# EAGLE schematic main_02_feb_18 (EAGLE 7.6.0), part 1 of 2
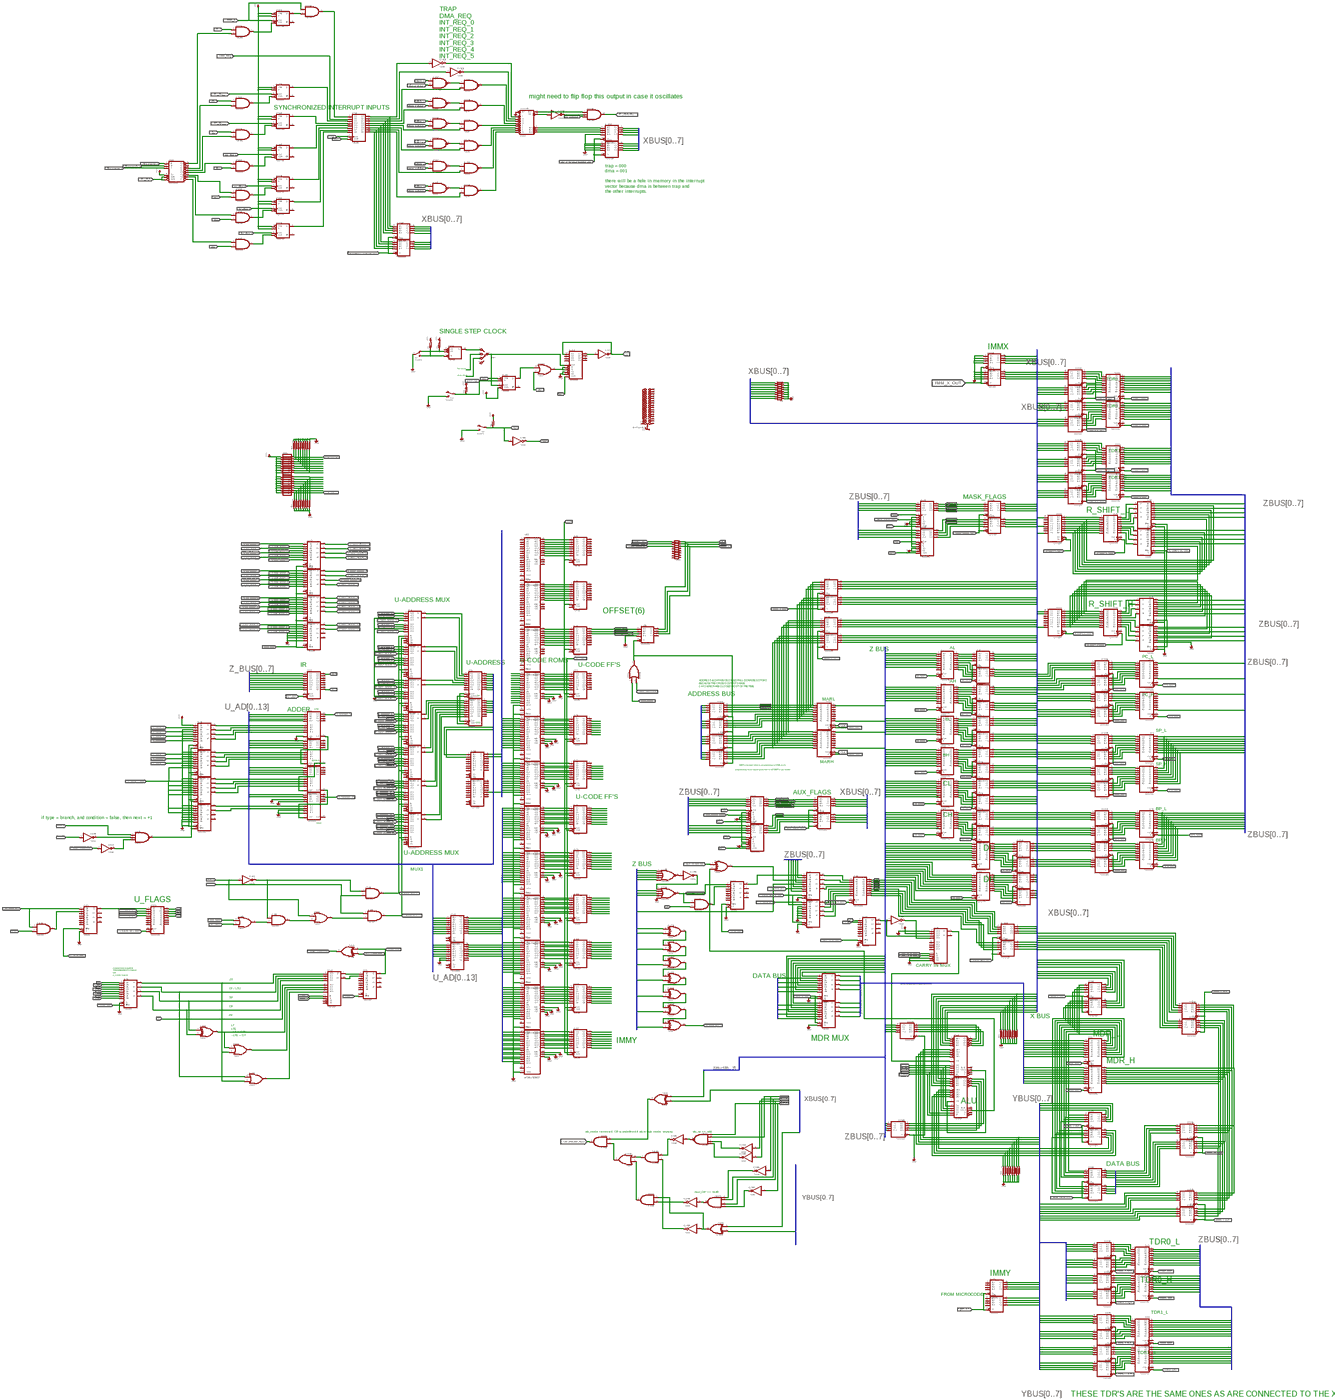
[diagram p0: schematic, sheet 1, overview]
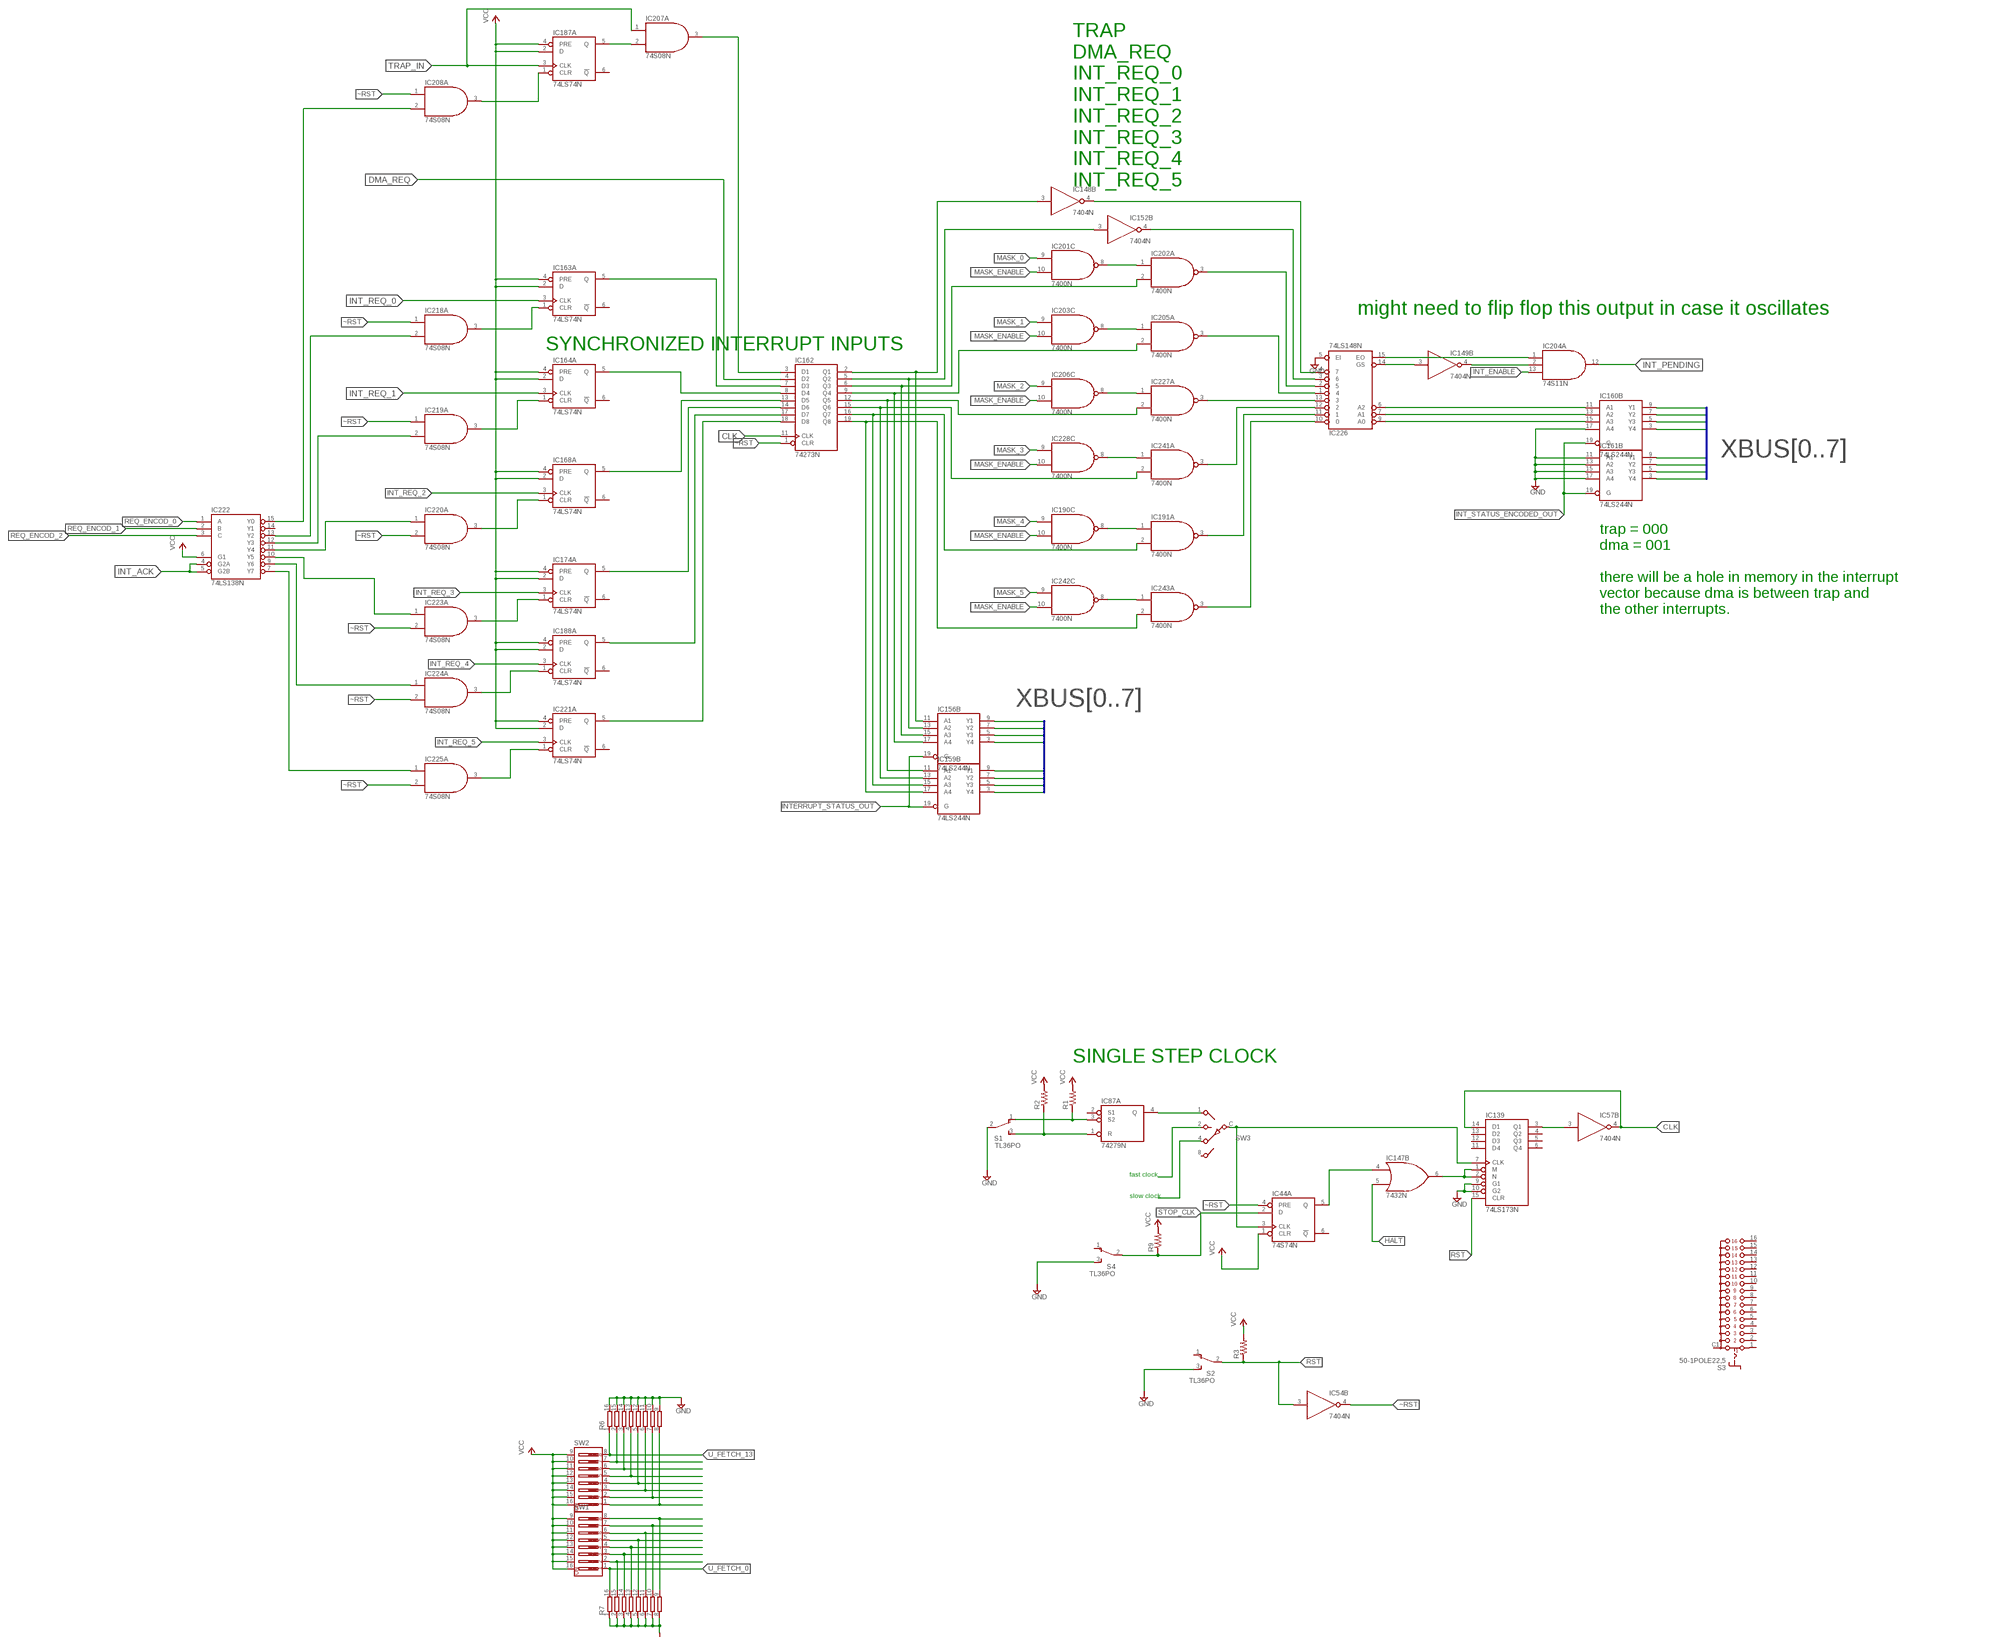
[diagram p1: schematic, sheet 1, part 1 of 7]
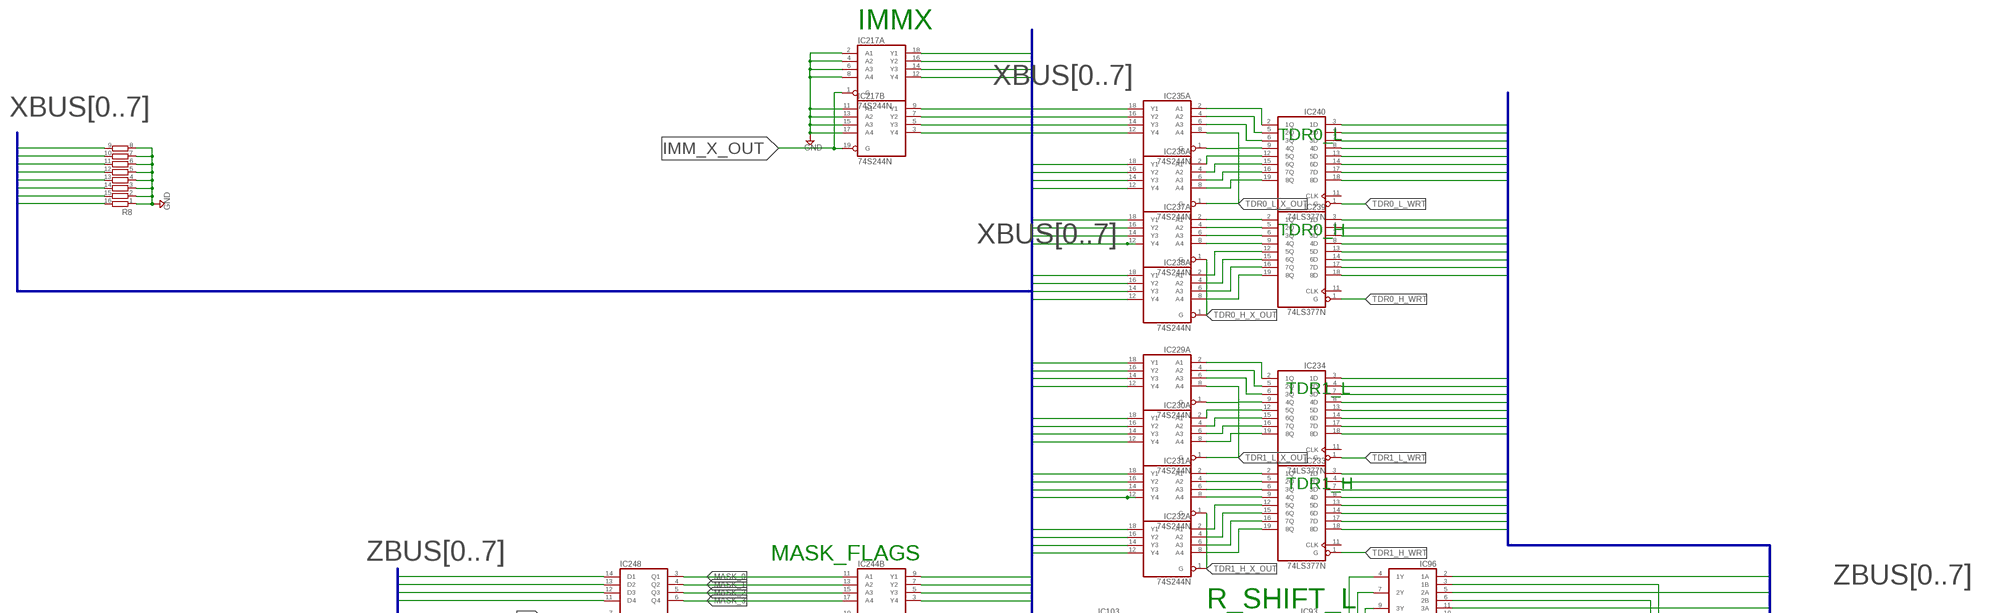
[diagram p2: schematic, sheet 1, part 2 of 7]
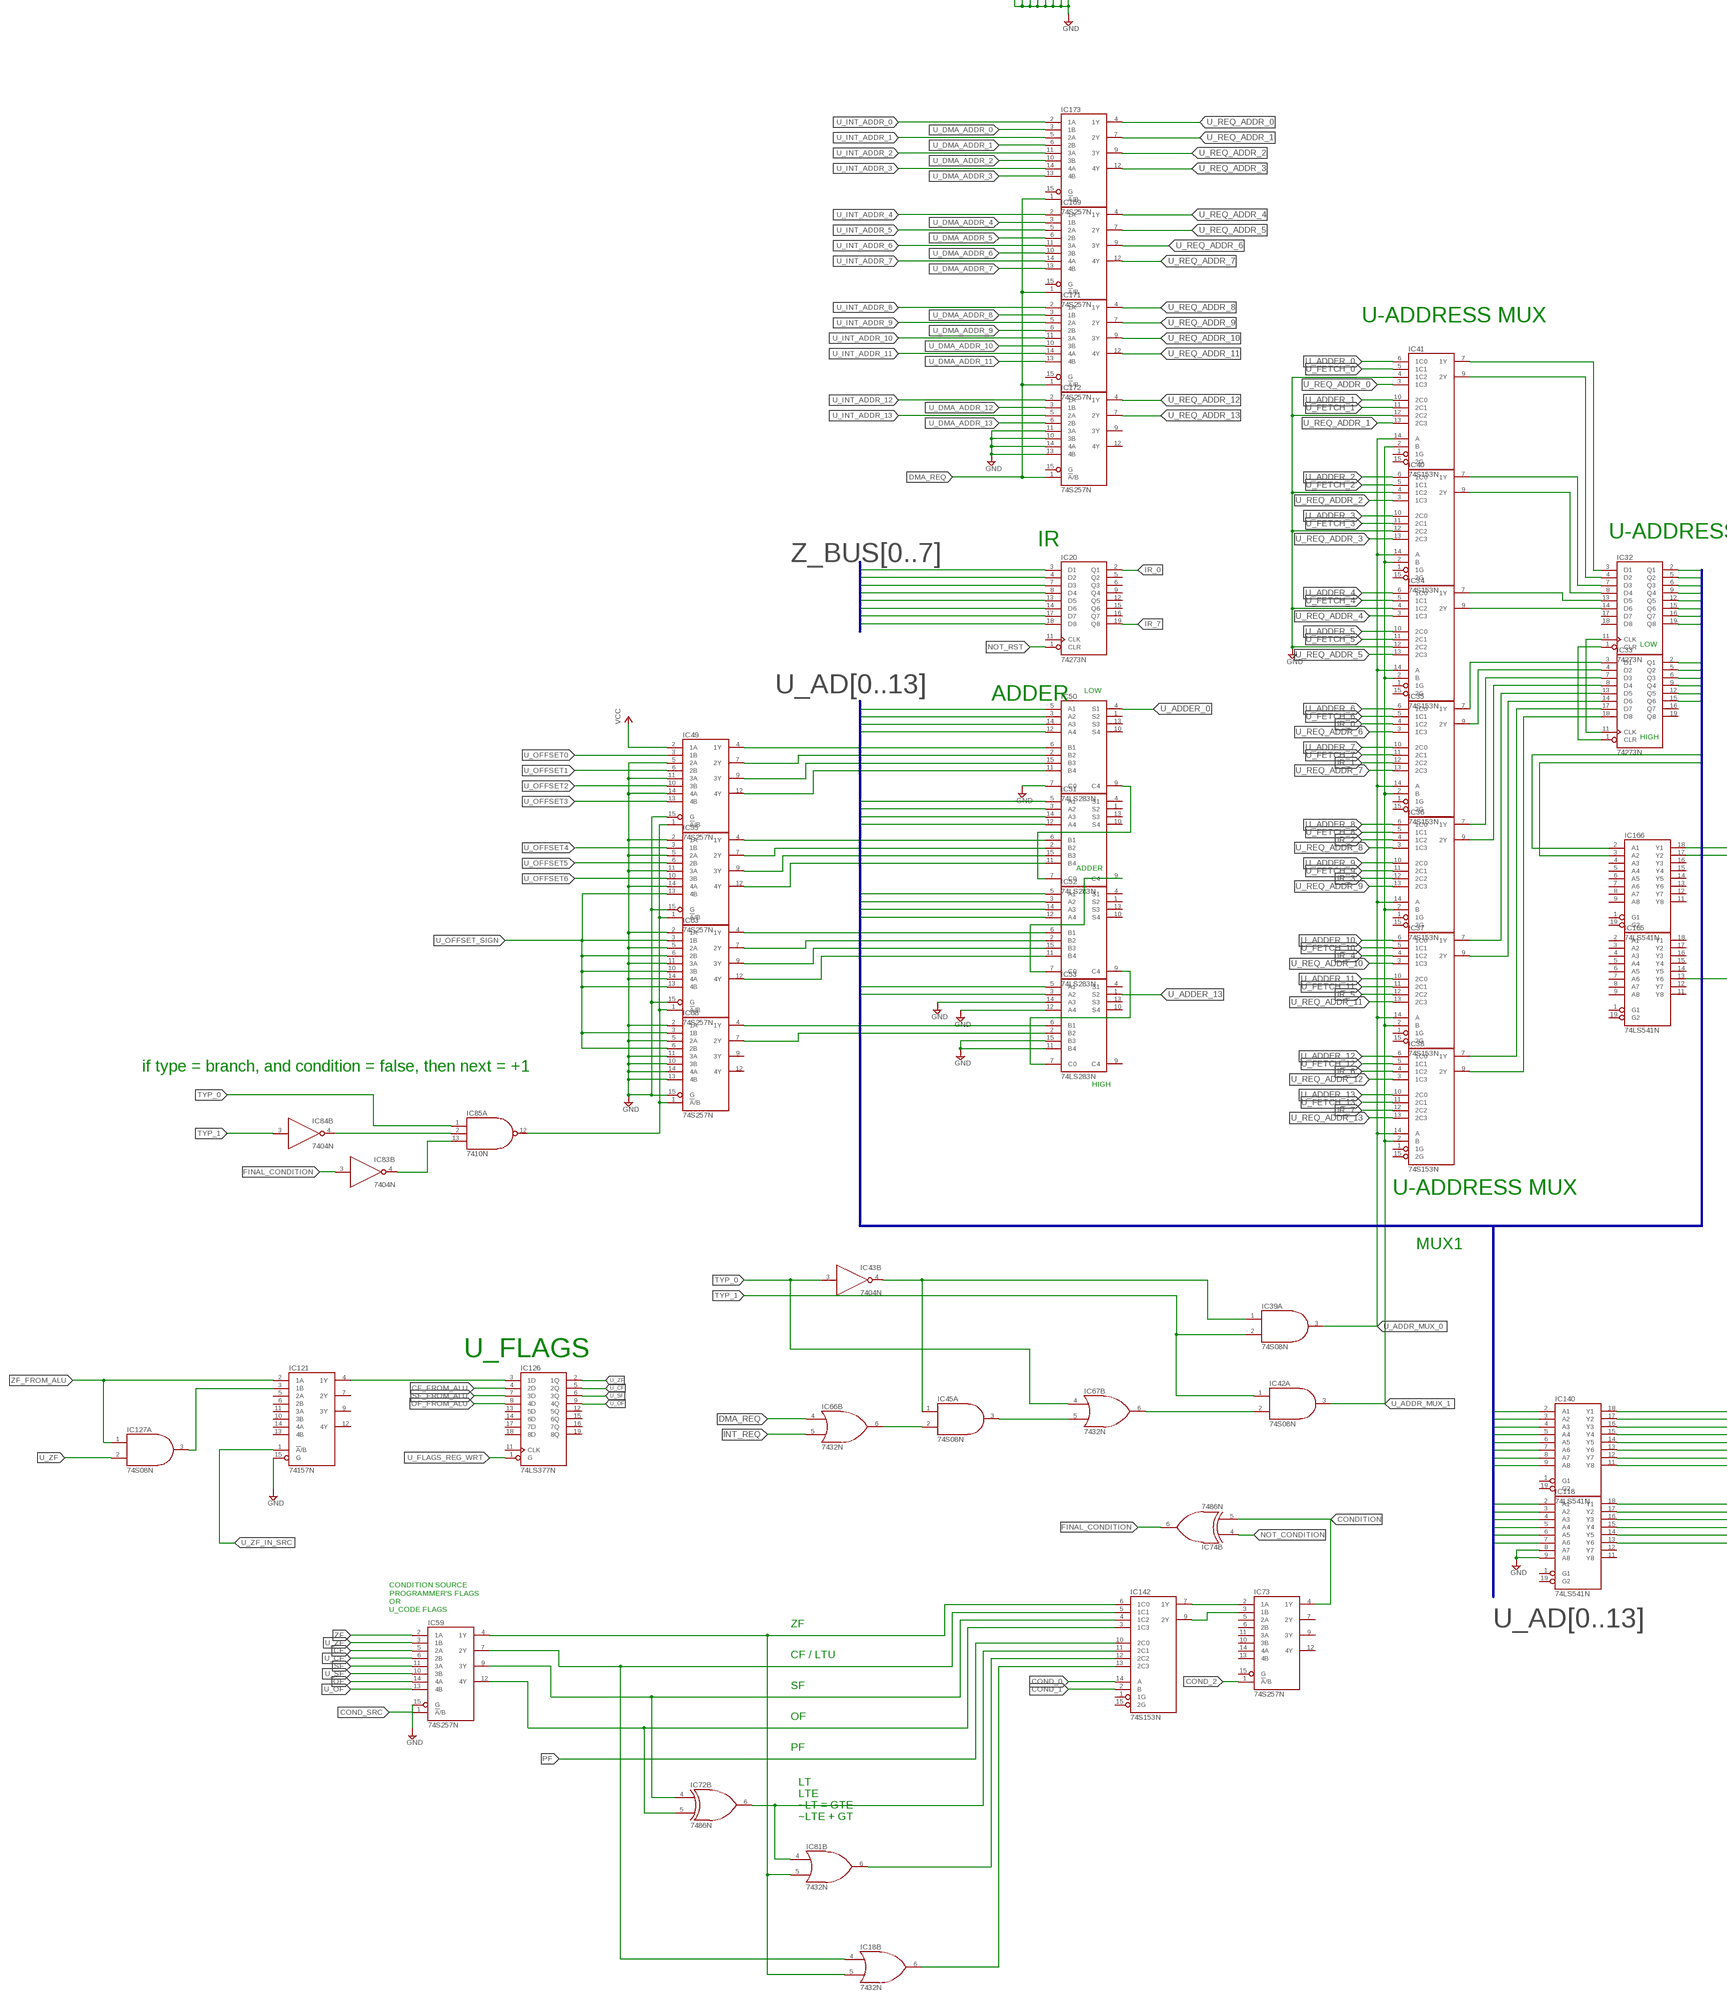
[diagram p3: schematic, sheet 1, part 3 of 7]
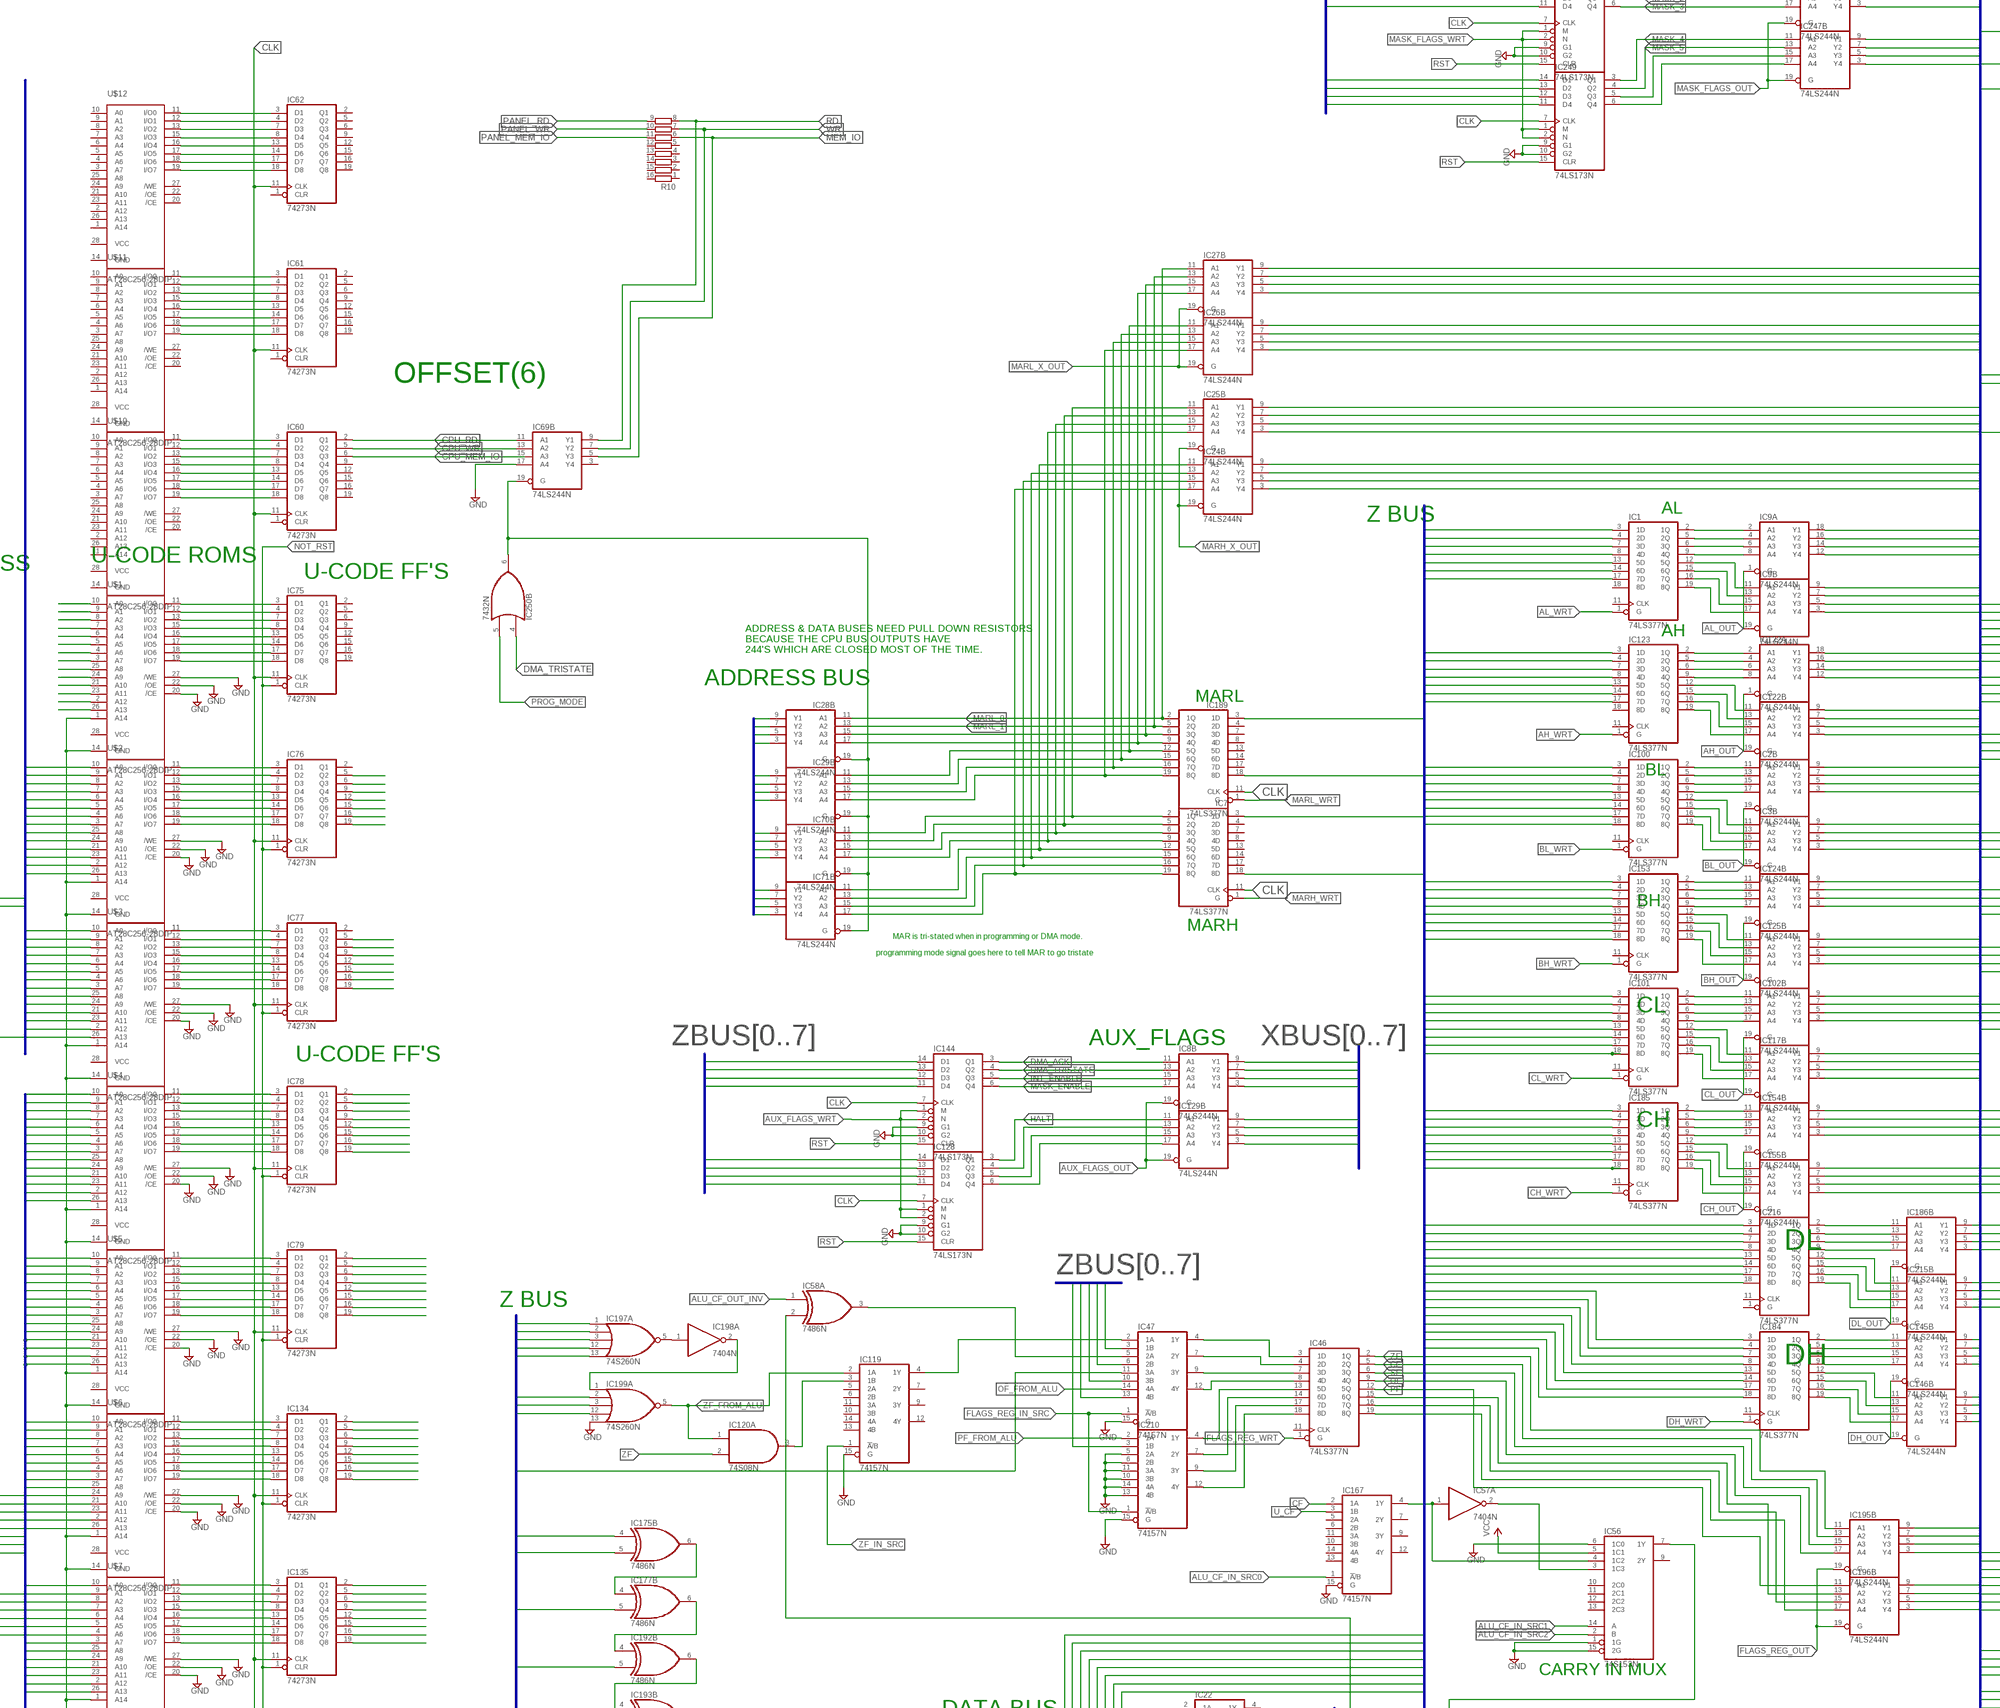
[diagram p4: schematic, sheet 1, part 4 of 7]
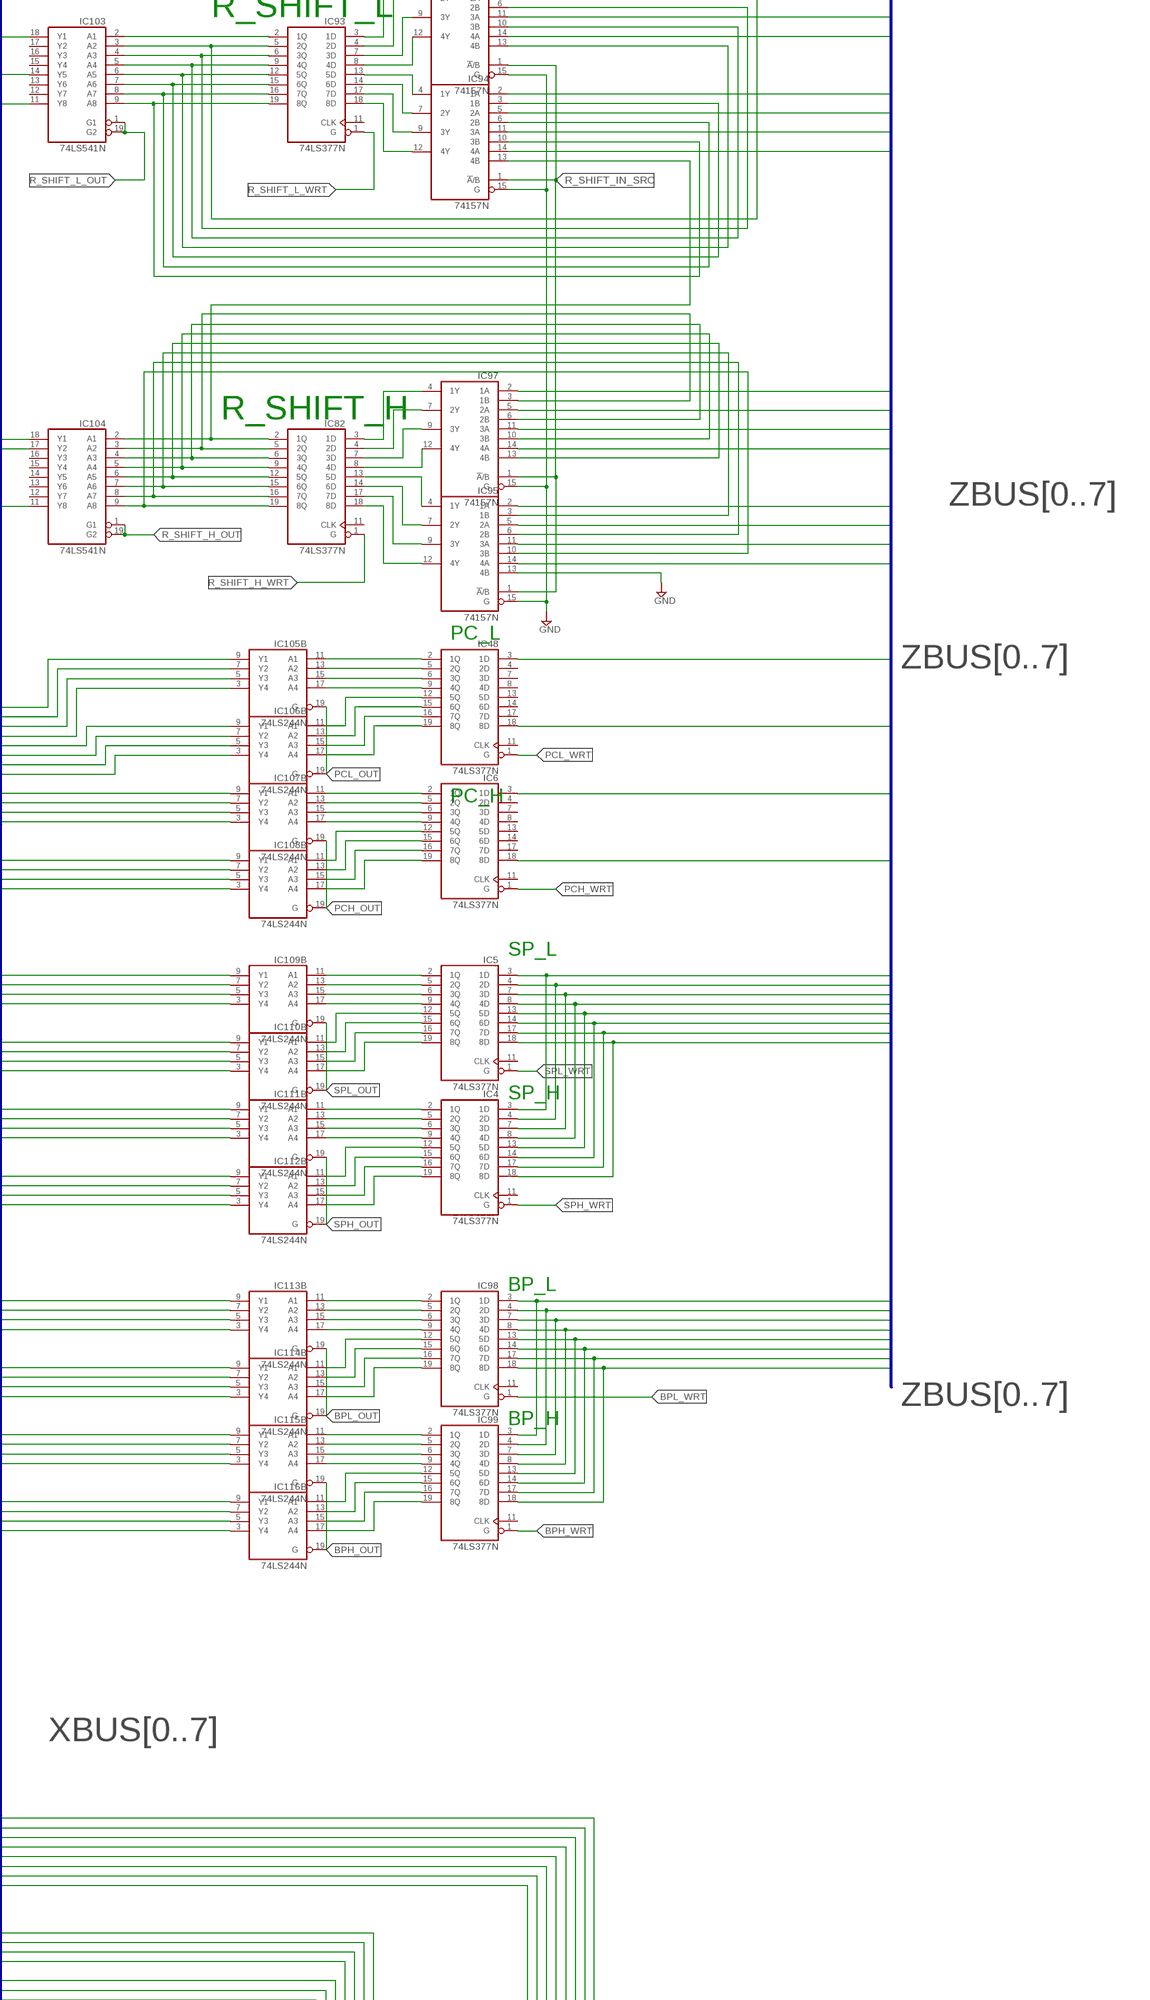
[diagram p5: schematic, sheet 1, part 5 of 7]
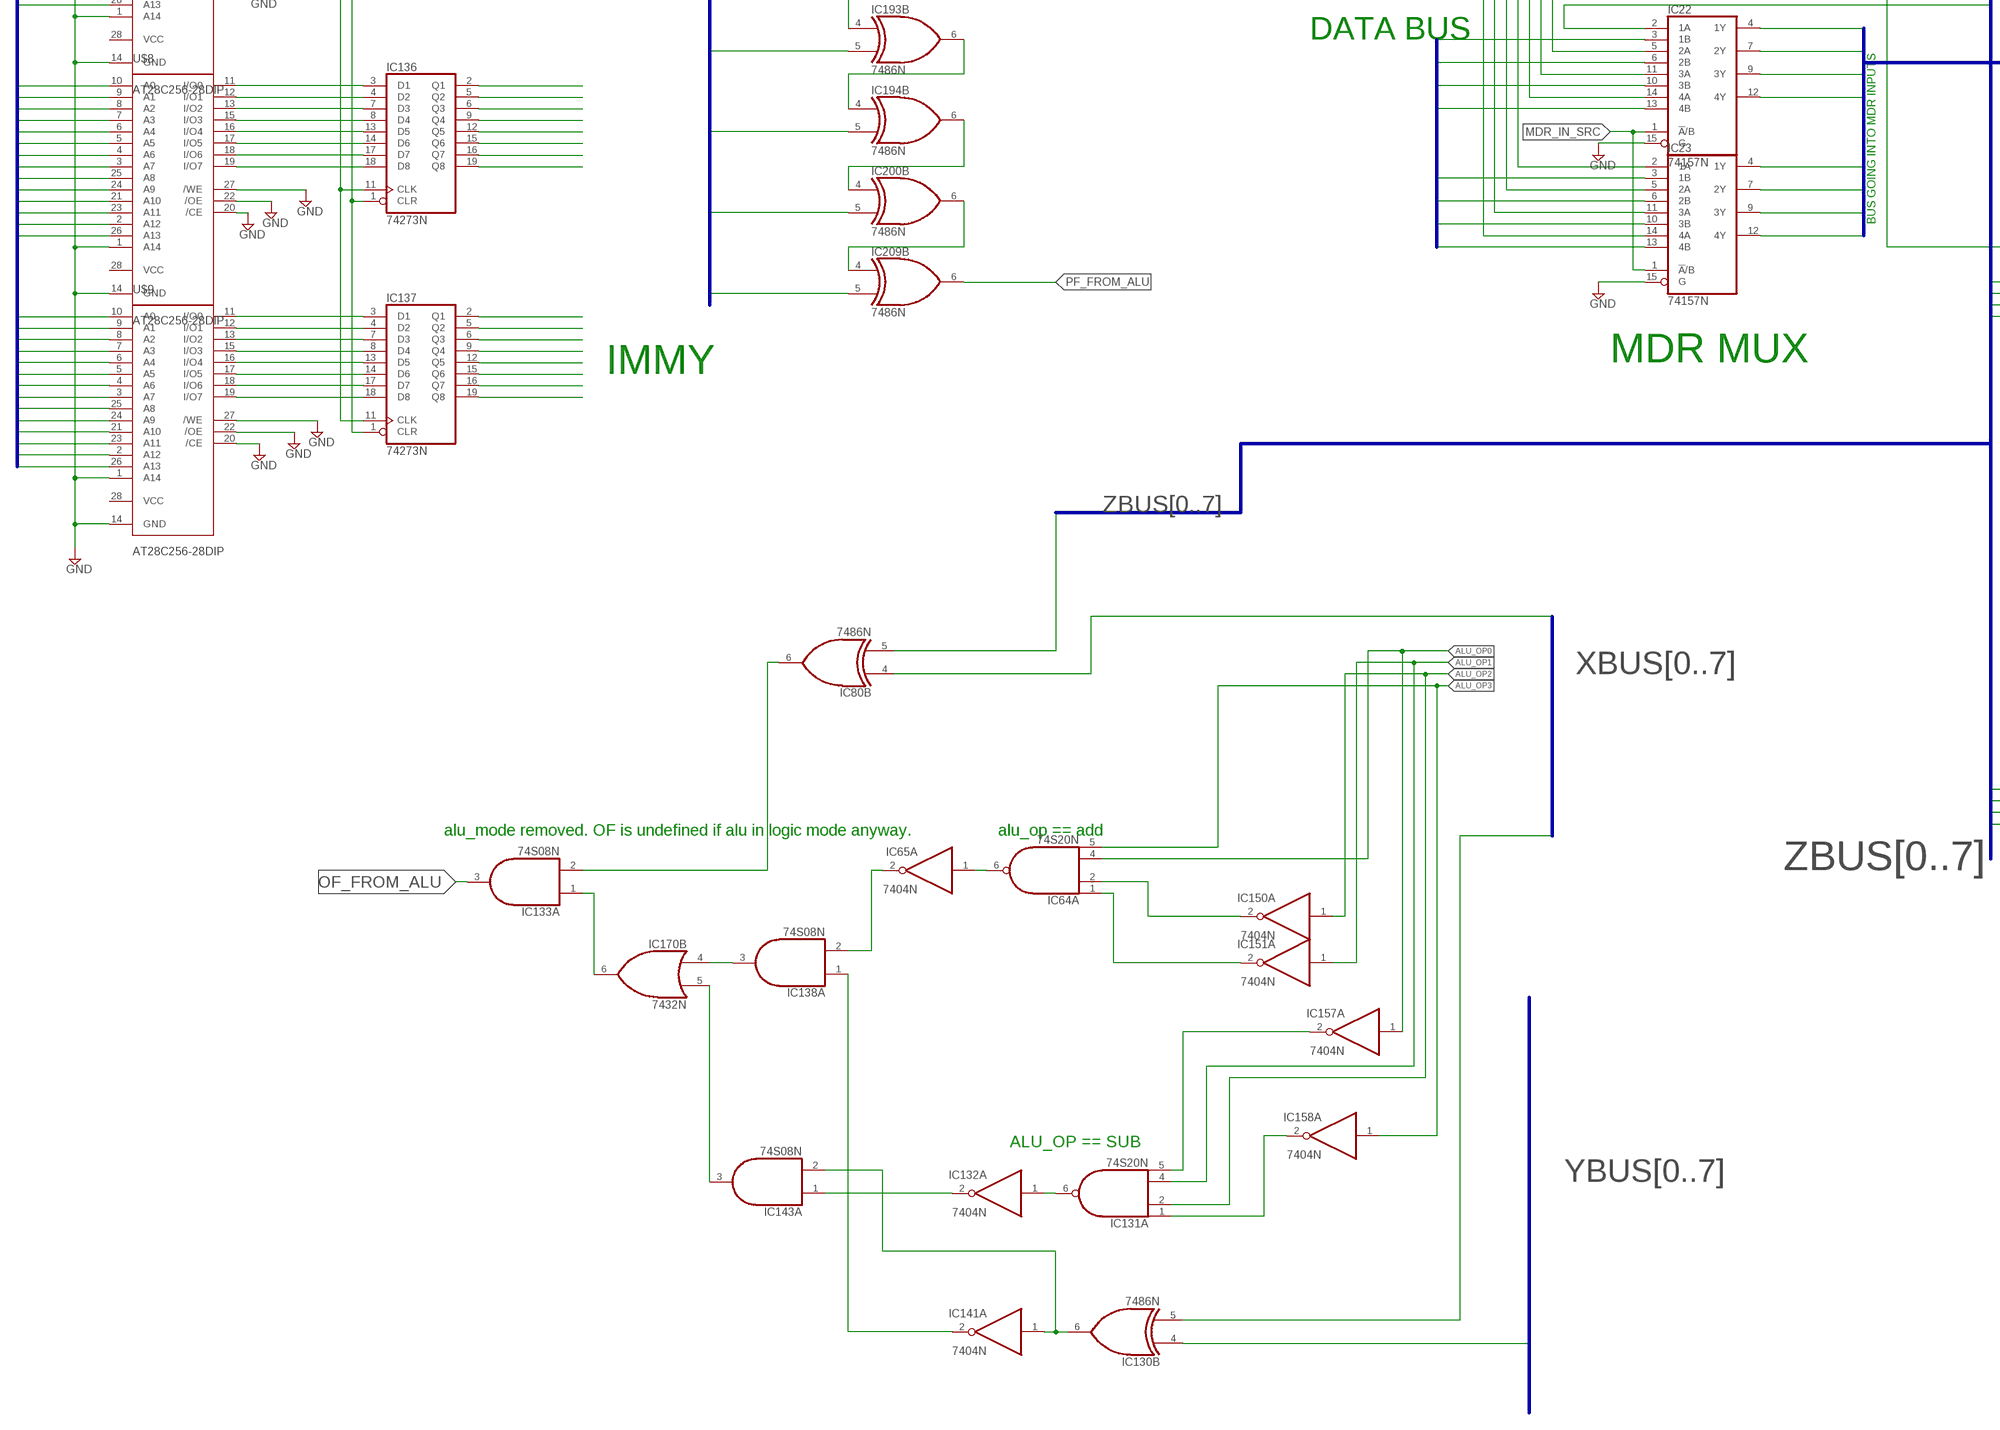
[diagram p6: schematic, sheet 1, part 6 of 7]
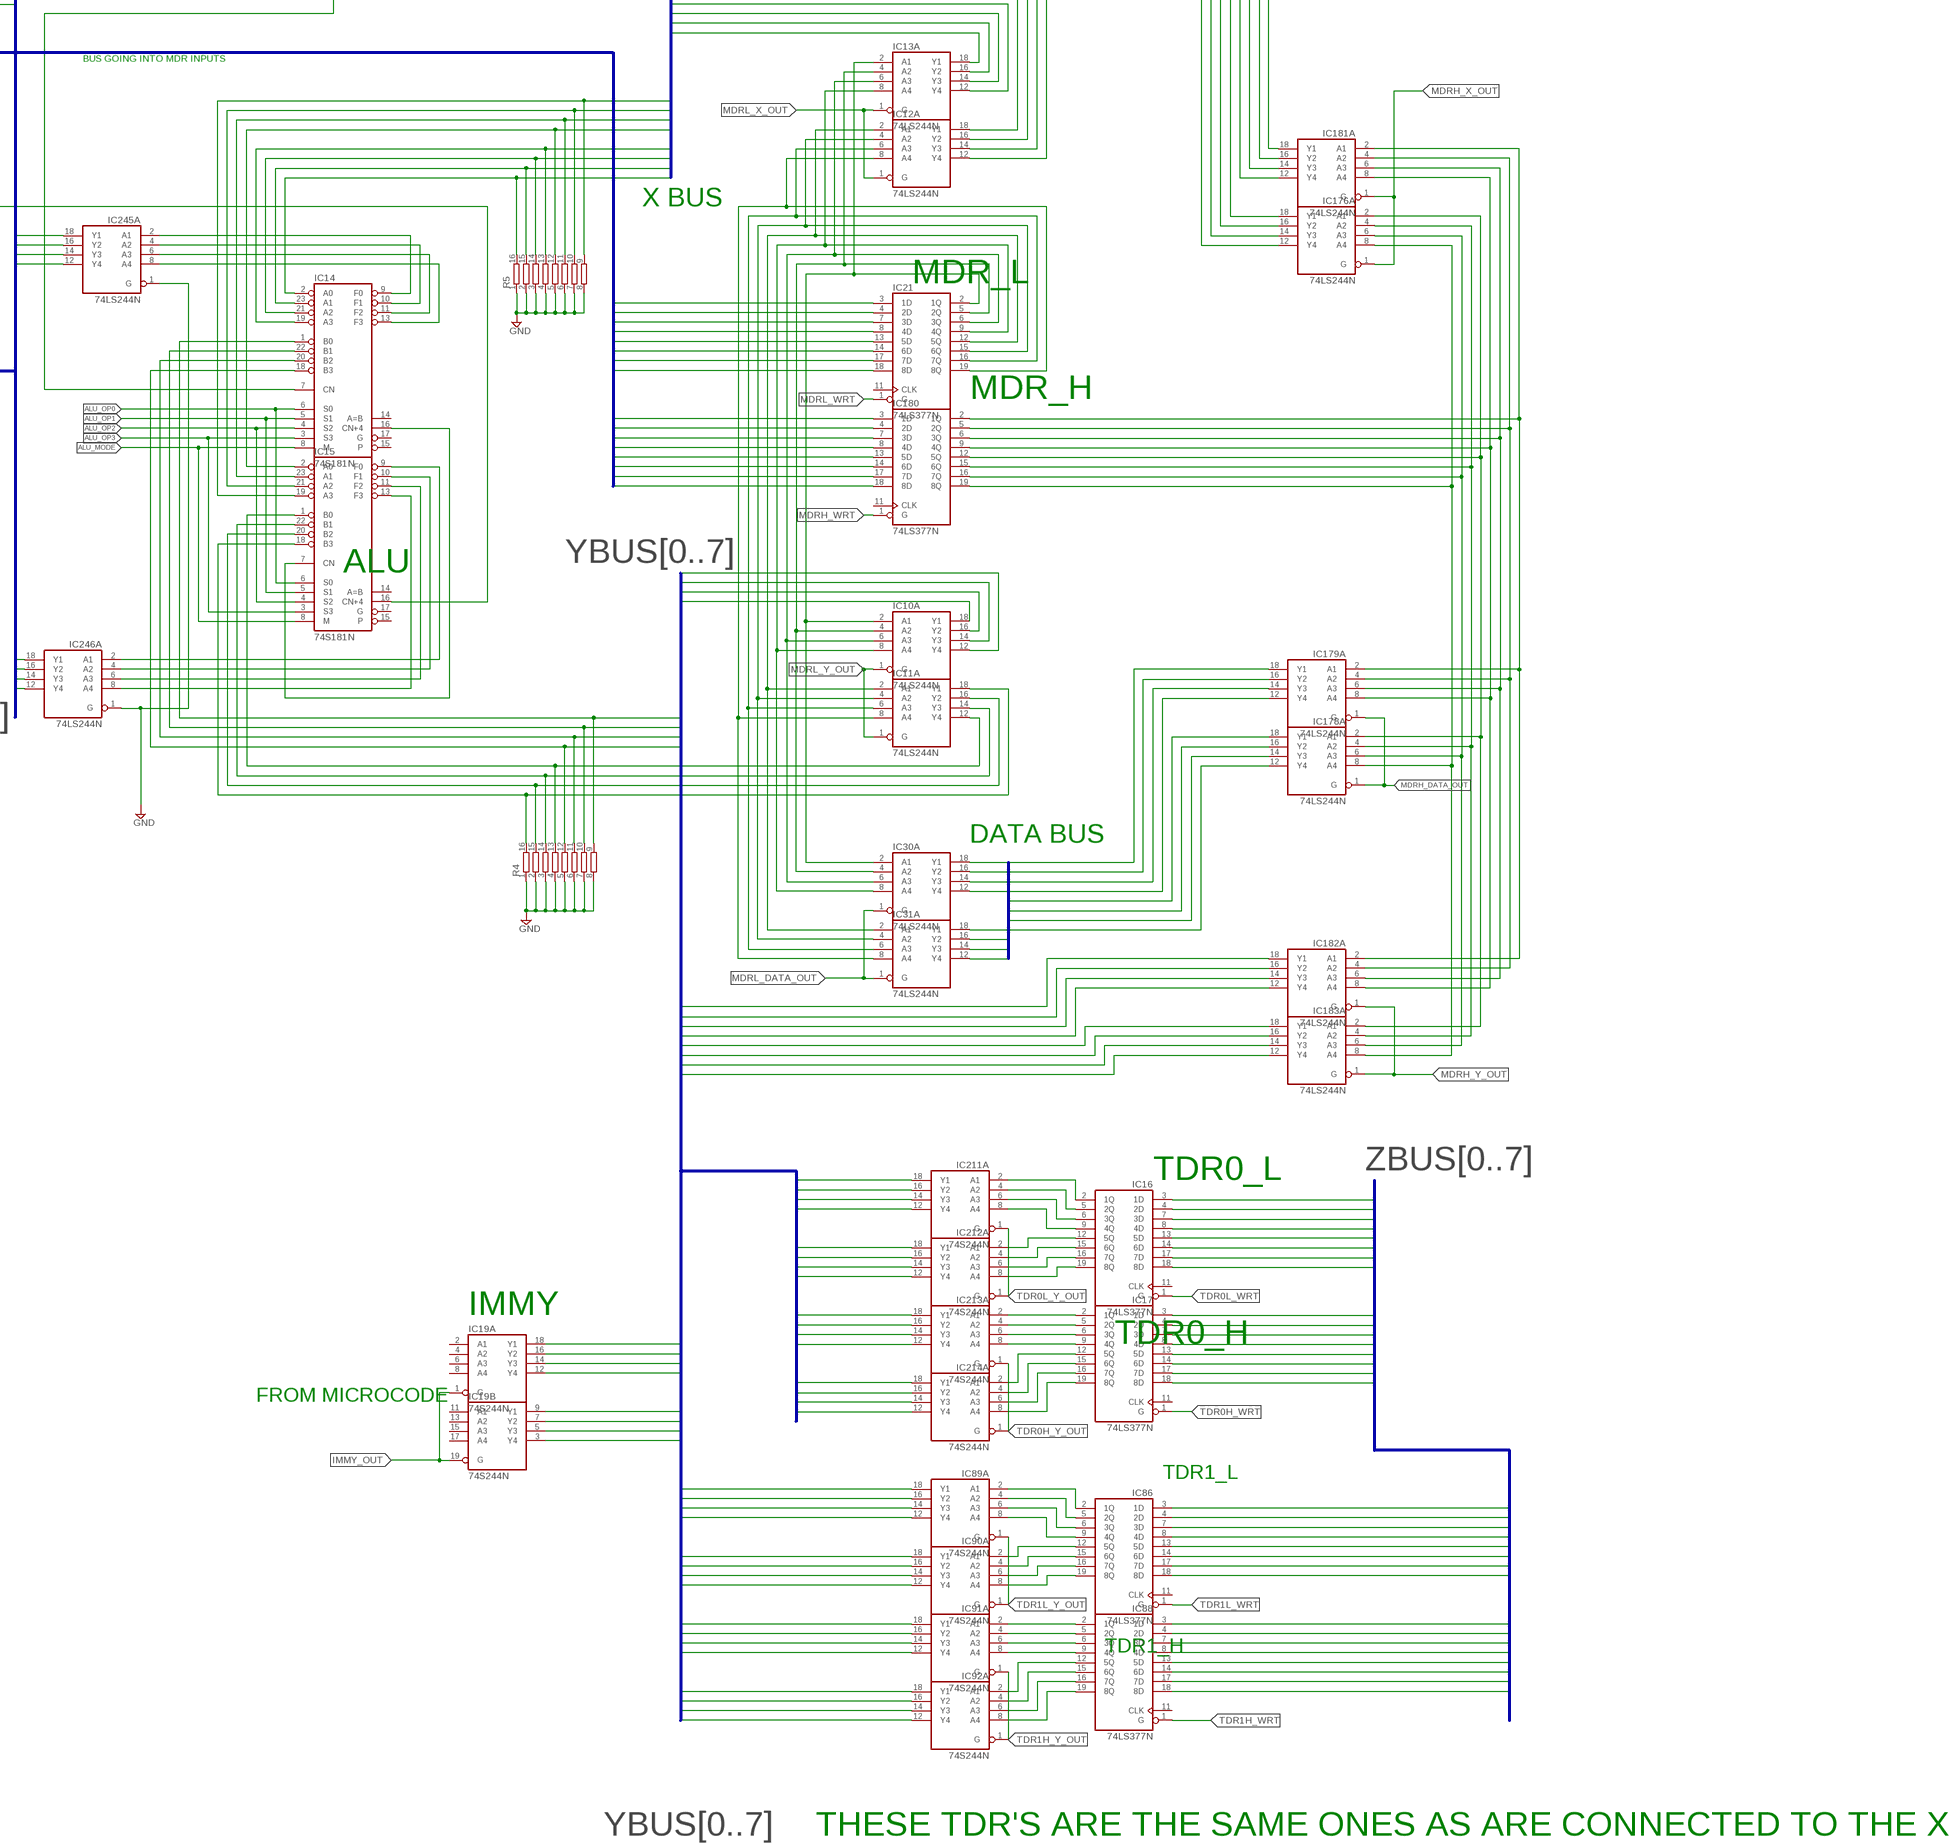
[diagram p7: schematic, sheet 1, part 7 of 7]

## Parts
IC1  74LS377N  [DIL20]
IC2  74LS244N  [DIL20]
IC3  74LS244N  [DIL20]
IC4  74LS377N  [DIL20]
IC5  74LS377N  [DIL20]
IC6  74LS377N  [DIL20]
IC7  74LS377N  [DIL20]
IC8  74LS244N  [DIL20]
IC9  74LS244N  [DIL20]
IC10  74LS244N  [DIL20]
IC11  74LS244N  [DIL20]
IC12  74LS244N  [DIL20]
IC13  74LS244N  [DIL20]
IC14  74S181N  [DIL24-6]
IC15  74S181N  [DIL24-6]
IC16  74LS377N  [DIL20]
IC17  74LS377N  [DIL20]
IC18  7432N  [DIL14]
IC19  74S244N  [DIL20]
IC20  74273N  [DIL20]
IC21  74LS377N  [DIL20]
IC22  74157N  [DIL16]
IC23  74157N  [DIL16]
IC24  74LS244N  [DIL20]
IC25  74LS244N  [DIL20]
IC26  74LS244N  [DIL20]
IC27  74LS244N  [DIL20]
IC28  74LS244N  [DIL20]
IC29  74LS244N  [DIL20]
IC30  74LS244N  [DIL20]
IC31  74LS244N  [DIL20]
IC32  74273N  [DIL20]
IC33  74273N  [DIL20]
IC34  74S153N  [DIL16]
IC35  74S153N  [DIL16]
IC36  74S153N  [DIL16]
IC37  74S153N  [DIL16]
IC38  74S153N  [DIL16]
IC39  74S08N  [DIL14]
IC40  74S153N  [DIL16]
IC41  74S153N  [DIL16]
IC42  74S08N  [DIL14]
IC43  7404N  [DIL14]
IC44  74S74N  [DIL14]
IC45  74S08N  [DIL14]
IC46  74LS377N  [DIL20]
IC47  74157N  [DIL16]
IC48  74LS377N  [DIL20]
IC49  74S257N  [DIL16]
IC50  74LS283N  [DIL16]
IC51  74LS283N  [DIL16]
IC52  74LS283N  [DIL16]
IC53  74LS283N  [DIL16]
IC54  7404N  [DIL14]
IC55  74S257N  [DIL16]
IC56  74S153N  [DIL16]
IC57  7404N  [DIL14]
IC58  7486N  [DIL14]
IC59  74S257N  [DIL16]
IC60  74273N  [DIL20]
IC61  74273N  [DIL20]
IC62  74273N  [DIL20]
IC63  74S257N  [DIL16]
IC64  74S20N  [DIL14]
IC65  7404N  [DIL14]
IC66  7432N  [DIL14]
IC67  7432N  [DIL14]
IC68  74S257N  [DIL16]
IC69  74LS244N  [DIL20]
IC70  74LS244N  [DIL20]
IC71  74LS244N  [DIL20]
IC72  7486N  [DIL14]
IC73  74S257N  [DIL16]
IC74  7486N  [DIL14]
IC75  74273N  [DIL20]
IC76  74273N  [DIL20]
IC77  74273N  [DIL20]
IC78  74273N  [DIL20]
IC79  74273N  [DIL20]
IC80  7486N  [DIL14]
IC81  7432N  [DIL14]
IC82  74LS377N  [DIL20]
IC83  7404N  [DIL14]
IC84  7404N  [DIL14]
IC85  7410N  [DIL14]
IC86  74LS377N  [DIL20]
IC87  74279N  [DIL16]
IC88  74LS377N  [DIL20]
IC89  74S244N  [DIL20]
IC90  74S244N  [DIL20]
IC91  74S244N  [DIL20]
IC92  74S244N  [DIL20]
IC93  74LS377N  [DIL20]
IC94  74157N  [DIL16]
IC95  74157N  [DIL16]
IC96  74157N  [DIL16]
IC97  74157N  [DIL16]
IC98  74LS377N  [DIL20]
IC99  74LS377N  [DIL20]
IC100  74LS377N  [DIL20]
IC101  74LS377N  [DIL20]
IC102  74LS244N  [DIL20]
IC103  74LS541N  [DIL20]
IC104  74LS541N  [DIL20]
IC105  74LS244N  [DIL20]
IC106  74LS244N  [DIL20]
IC107  74LS244N  [DIL20]
IC108  74LS244N  [DIL20]
IC109  74LS244N  [DIL20]
IC110  74LS244N  [DIL20]
IC111  74LS244N  [DIL20]
IC112  74LS244N  [DIL20]
IC113  74LS244N  [DIL20]
IC114  74LS244N  [DIL20]
IC115  74LS244N  [DIL20]
IC116  74LS244N  [DIL20]
IC117  74LS244N  [DIL20]
IC118  74LS541N  [DIL20]
IC119  74157N  [DIL16]
IC120  74S08N  [DIL14]
IC121  74157N  [DIL16]
IC122  74LS244N  [DIL20]
IC123  74LS377N  [DIL20]
IC124  74LS244N  [DIL20]
IC125  74LS244N  [DIL20]
IC126  74LS377N  [DIL20]
IC127  74S08N  [DIL14]
IC128  74LS173N  [DIL16]
IC129  74LS244N  [DIL20]
IC130  7486N  [DIL14]
IC131  74S20N  [DIL14]
IC132  7404N  [DIL14]
IC133  74S08N  [DIL14]
IC134  74273N  [DIL20]
IC135  74273N  [DIL20]
IC136  74273N  [DIL20]
IC137  74273N  [DIL20]
IC138  74S08N  [DIL14]
IC139  74LS173N  [DIL16]
IC140  74LS541N  [DIL20]
IC141  7404N  [DIL14]
IC142  74S153N  [DIL16]
IC143  74S08N  [DIL14]
IC144  74LS173N  [DIL16]
IC145  74LS244N  [DIL20]
IC146  74LS244N  [DIL20]
IC147  7432N  [DIL14]
IC148  7404N  [DIL14]
IC149  7404N  [DIL14]
IC150  7404N  [DIL14]
IC151  7404N  [DIL14]
IC152  7404N  [DIL14]
IC153  74LS377N  [DIL20]
IC154  74LS244N  [DIL20]
IC155  74LS244N  [DIL20]
IC156  74LS244N  [DIL20]
IC157  7404N  [DIL14]
IC158  7404N  [DIL14]
IC159  74LS244N  [DIL20]
IC160  74LS244N  [DIL20]
IC161  74LS244N  [DIL20]
IC162  74273N  [DIL20]
IC163  74LS74N  [DIL14]
IC164  74LS74N  [DIL14]
IC165  74LS541N  [DIL20]
IC166  74LS541N  [DIL20]
IC167  74157N  [DIL16]
IC168  74LS74N  [DIL14]
IC169  74S257N  [DIL16]
IC170  7432N  [DIL14]
IC171  74S257N  [DIL16]
IC172  74S257N  [DIL16]
IC173  74S257N  [DIL16]
IC174  74LS74N  [DIL14]
IC175  7486N  [DIL14]
IC176  74LS244N  [DIL20]
IC177  7486N  [DIL14]
IC178  74LS244N  [DIL20]
IC179  74LS244N  [DIL20]
IC180  74LS377N  [DIL20]
IC181  74LS244N  [DIL20]
IC182  74LS244N  [DIL20]
IC183  74LS244N  [DIL20]
IC184  74LS377N  [DIL20]
IC185  74LS377N  [DIL20]
IC186  74LS244N  [DIL20]
IC187  74LS74N  [DIL14]
IC188  74LS74N  [DIL14]
IC189  74LS377N  [DIL20]
IC190  7400N  [DIL14]
IC191  7400N  [DIL14]
IC192  7486N  [DIL14]
IC193  7486N  [DIL14]
IC194  7486N  [DIL14]
IC195  74LS244N  [DIL20]
IC196  74LS244N  [DIL20]
IC197  74S260N  [DIL14]
IC198  7404N  [DIL14]
IC199  74S260N  [DIL14]
IC200  7486N  [DIL14]
IC201  7400N  [DIL14]
IC202  7400N  [DIL14]
IC203  7400N  [DIL14]
IC204  74S11N  [DIL14]
IC205  7400N  [DIL14]
IC206  7400N  [DIL14]
IC207  74S08N  [DIL14]
IC208  74S08N  [DIL14]
IC209  7486N  [DIL14]
IC210  74157N  [DIL16]
IC211  74S244N  [DIL20]
IC212  74S244N  [DIL20]
IC213  74S244N  [DIL20]
IC214  74S244N  [DIL20]
IC215  74LS244N  [DIL20]
IC216  74LS377N  [DIL20]
IC217  74S244N  [DIL20]
IC218  74S08N  [DIL14]
IC219  74S08N  [DIL14]
IC220  74S08N  [DIL14]
IC221  74LS74N  [DIL14]
IC222  74LS138N  [DIL16]
IC223  74S08N  [DIL14]
IC224  74S08N  [DIL14]
IC225  74S08N  [DIL14]
IC226  74LS148N  [DIL16]
IC227  7400N  [DIL14]
IC228  7400N  [DIL14]
IC229  74S244N  [DIL20]
IC230  74S244N  [DIL20]
IC231  74S244N  [DIL20]
IC232  74S244N  [DIL20]
IC233  74LS377N  [DIL20]
IC234  74LS377N  [DIL20]
IC235  74S244N  [DIL20]
IC236  74S244N  [DIL20]
IC237  74S244N  [DIL20]
IC238  74S244N  [DIL20]
IC239  74LS377N  [DIL20]
IC240  74LS377N  [DIL20]
IC241  7400N  [DIL14]
IC242  7400N  [DIL14]
IC243  7400N  [DIL14]
IC244  74LS244N  [DIL20]
IC245  74LS244N  [DIL20]
IC246  74LS244N  [DIL20]
IC247  74LS244N  [DIL20]
IC248  74LS173N  [DIL16]
IC249  74LS173N  [DIL16]
IC250  7432N  [DIL14]
R1  R-US_0204/2V  [0204V]
R2  R-US_0204/2V  [0204V]
R3  R-US_0204/2V  [0204V]
R4  4816P-T01  [4816P]
R5  4816P-T01  [4816P]
R6  4816P-T01  [4816P]
R7  4816P-T01  [4816P]
R8  4816P-T01  [4816P]
R9  R-US_0204/2V  [0204V]
R10  4816P-T01  [4816P]
S1  TL36PO  [TL3XPO]
S2  TL36PO  [TL3XPO]
S3  50-1POLE22,5  [50-1POLE22,5]
S4  TL36PO  [TL3XPO]
SW1  SW_DIP-8  [EDG-08]
SW2  SW_DIP-8  [EDG-08]
SW3  SW-C10  [SW-C10]
U$1  AT28C256-28DIP  [DIL28-6]
U$2  AT28C256-28DIP  [DIL28-6]
U$3  AT28C256-28DIP  [DIL28-6]
U$4  AT28C256-28DIP  [DIL28-6]
U$5  AT28C256-28DIP  [DIL28-6]
U$6  AT28C256-28DIP  [DIL28-6]
U$7  AT28C256-28DIP  [DIL28-6]
U$8  AT28C256-28DIP  [DIL28-6]
U$9  AT28C256-28DIP  [DIL28-6]
U$10  AT28C256-28DIP  [DIL28-6]
U$11  AT28C256-28DIP  [DIL28-6]
U$12  AT28C256-28DIP  [DIL28-6]

## Nets
45435: IC18.5(B:I1) IC59.4(1Y) IC81.5(B:I1) IC142.6(1C0)
345345: IC59.9(3Y) IC72.4(B:I0) IC142.4(1C2)
634354: IC18.4(B:I0) IC59.7(2Y) IC142.5(1C1)
654654: IC46.16(7Q) IC196.15(B:A3)
4654654: IC59.12(4Y) IC72.5(B:I1) IC142.3(1C3)
5434534: IC46.15(6Q) IC196.13(B:A2)
AD0: IC28.9(B:Y1)
AD1: IC28.7(B:Y2)
AD2: IC28.5(B:Y3)
AD3: IC28.3(B:Y4)
AD4: IC29.9(B:Y1)
AD5: IC29.7(B:Y2)
AD6: IC29.5(B:Y3)
AD7: IC29.3(B:Y4)
AD8: IC70.9(B:Y1)
AD9: IC70.7(B:Y2)
AD10: IC70.5(B:Y3)
AD11: IC70.3(B:Y4)
AD12: IC71.9(B:Y1)
AD13: IC71.7(B:Y2)
AD14: IC71.5(B:Y3)
AD15: IC71.3(B:Y4)
AH_OUT: IC122.1(A:G) IC122.19(B:G)
AH_WRT: IC123.1(G)
AL_OUT: IC9.1(A:G) IC9.19(B:G)
AL_WRT: IC1.1(G)
ALU_CF_IN_SRC0: IC167.1(!A!/B)
ALU_CF_IN_SRC1: IC56.14(A)
ALU_CF_IN_SRC2: IC56.2(B)
ALU_CF_OUT_INV: IC58.1(A:I0)
ALU_MODE: IC14.8(M) IC15.8(M)
ALU_OP0: IC14.6(S0) IC15.6(S0) IC64.4(A:I2) IC157.1(A:I)
ALU_OP1: IC14.5(S1) IC15.5(S1) IC131.4(A:I2) IC151.1(A:I)
ALU_OP2: IC14.4(S2) IC15.4(S2) IC131.2(A:I1) IC150.1(A:I)
ALU_OP3: IC14.3(S3) IC15.3(S3) IC64.5(A:I3) IC158.1(A:I)
AUX_FLAGS_OUT: IC8.19(B:G) IC129.19(B:G)
AUX_FLAGS_WRT: IC128.1(M) IC128.2(N) IC144.1(M) IC144.2(N)
BH_OUT: IC124.19(B:G) IC125.19(B:G)
BH_WRT: IC153.1(G)
BL_OUT: IC2.19(B:G) IC3.19(B:G)
BL_WRT: IC100.1(G)
BPH_OUT: IC115.19(B:G) IC116.19(B:G)
BPH_WRT: IC99.1(G)
BPL_OUT: IC113.19(B:G) IC114.19(B:G)
BPL_WRT: IC98.1(G)
CF: IC46.5(2Q) IC59.5(2A) IC167.2(1A) IC195.13(B:A2)
CF_FROM_ALU: IC126.4(2D)
CH_OUT: IC154.19(B:G) IC155.19(B:G)
CH_WRT: IC185.1(G)
CL_OUT: IC102.19(B:G) IC117.19(B:G)
CL_WRT: IC101.1(G)
CLK: IC7.11(CLK) IC57.4(B:O) IC60.11(CLK) IC61.11(CLK) IC62.11(CLK) IC75.11(CLK) IC76.11(CLK) IC77.11(CLK) IC78.11(CLK) IC79.11(CLK) IC128.7(CLK) IC134.11(CLK) IC135.11(CLK) IC136.11(CLK) IC137.11(CLK) IC139.14(D1) IC144.7(CLK) IC162.11(CLK) IC189.11(CLK) IC248.7(CLK) IC249.7(CLK)
COND_0: IC142.14(A)
COND_1: IC142.2(B)
COND_2: IC73.1(!A!/B)
COND_SRC: IC59.1(!A!/B)
CONDITION: IC73.4(1Y) IC74.5(B:I1)
CPU_MEM_IO: IC60.6(Q3)
CPU_RD: IC60.2(Q1) IC69.11(B:A1)
CPU_WR: IC60.5(Q2) IC69.13(B:A2)
DATA0: IC20.3(D1) IC179.18(A:Y1)
DATA1: IC20.4(D2) IC179.16(A:Y2)
DATA2: IC20.7(D3) IC179.14(A:Y3)
DATA3: IC20.8(D4) IC179.12(A:Y4)
DATA4: IC20.13(D5) IC178.18(A:Y1)
DATA5: IC20.14(D6) IC178.16(A:Y2)
DATA6: IC20.17(D7) IC178.14(A:Y3)
DATA7: IC20.18(D8) IC178.12(A:Y4)
DH_OUT: IC145.19(B:G) IC146.19(B:G)
DH_WRT: IC184.1(G)
DL_OUT: IC186.19(B:G) IC215.19(B:G)
DMA_ACK: IC8.11(B:A1) IC144.3(Q1)
DMA_REQ: IC66.4(B:I0) IC162.4(D2) IC169.1(!A!/B) IC171.1(!A!/B) IC172.1(!A!/B) IC173.1(!A!/B)
DMA_TRISTATE: IC8.13(B:A2) IC28.19(B:G) IC29.19(B:G) IC69.19(B:G) IC70.19(B:G) IC71.19(B:G) IC144.4(Q2) IC250.4(B:I0) IC250.6(B:O)
FINAL_CONDITION: IC74.6(B:O) IC83.3(B:I)
FLAGS_REG_IN_SRC: IC47.1(!A!/B) IC210.1(!A!/B)
FLAGS_REG_OUT: IC195.19(B:G) IC196.19(B:G)
GND: IC22.15(G) IC23.15(G) IC34.4(1C2) IC34.12(2C2) IC40.4(1C2) IC40.12(2C2) IC41.4(1C2) IC41.12(2C2) IC47.15(G) IC49.5(2A) IC49.11(3A) IC49.14(4A) IC49.15(G) IC50.7(C0) IC53.11(B4) IC53.12(A4) IC53.14(A3) IC53.15(B3) IC55.2(1A) IC55.5(2A) IC55.11(3A) IC55.14(4A) IC55.15(G) IC56.1(1G) IC56.6(1C0) IC56.15(2G) IC59.15(G) IC63.2(1A) IC63.5(2A) IC63.11(3A) IC63.14(4A) IC63.15(G) IC68.2(1A) IC68.5(2A) IC68.10(3B) IC68.11(3A) IC68.13(4B) IC68.14(4A) IC68.15(G) IC69.17(B:A4) IC94.15(G) IC95.13(4B) IC95.15(G) IC96.15(G) IC97.15(G) IC118.8(A7) IC118.9(A8) IC119.15(G) IC121.15(G) IC128.9(G1) IC128.10(G2) IC139.9(G1) IC139.10(G2) IC144.9(G1) IC144.10(G2) IC160.17(B:A4) IC161.11(B:A1) IC161.13(B:A2) IC161.15(B:A3) IC161.17(B:A4) IC167.15(G) IC172.10(3B) IC172.11(3A) IC172.13(4B) IC172.14(4A) IC199.13(A:I4) IC210.5(2A) IC210.6(2B) IC210.10(3B) IC210.11(3A) IC210.13(4B) IC210.14(4A) IC210.15(G) IC217.2(A:A1) IC217.4(A:A2) IC217.6(A:A3) IC217.8(A:A4) IC217.11(B:A1) IC217.13(B:A2) IC217.15(B:A3) IC217.17(B:A4) IC226.5(EI) IC245.1(A:G) IC246.1(A:G) IC248.9(G1) IC248.10(G2) IC249.9(G1) IC249.10(G2) R4.1 R4.2 R4.3 R4.4 R4.5 R4.6 R4.7 R4.8 R5.1 R5.2 R5.3 R5.4 R5.5 R5.6 R5.7 R5.8 R6.9 R6.10 R6.11 R6.12 R6.13 R6.14 R6.15 R6.16 R7.1 R7.2 R7.3 R7.4 R7.5 R7.6 R7.7 R7.8 R8.1 R8.2 R8.3 R8.4 R8.5 R8.6 R8.7 R8.8 S1.2(P) S2.3(S) S4.3(S) U$1.1(A14) U$1.14(GND) U$1.20(/CE) U$1.22(/OE) U$1.27(/WE) U$2.1(A14) U$2.14(GND) U$2.20(/CE) U$2.22(/OE) U$2.27(/WE) U$3.1(A14) U$3.14(GND) U$3.20(/CE) U$3.22(/OE) U$3.27(/WE) U$4.1(A14) U$4.14(GND) U$4.20(/CE) U$4.22(/OE) U$4.27(/WE) U$5.1(A14) U$5.14(GND) U$5.20(/CE) U$5.22(/OE) U$5.27(/WE) U$6.1(A14) U$6.14(GND) U$6.20(/CE) U$6.22(/OE) U$6.27(/WE) U$7.1(A14) U$7.14(GND) U$7.20(/CE) U$7.22(/OE) U$7.27(/WE) U$8.1(A14) U$8.14(GND) U$8.20(/CE) U$8.22(/OE) U$8.27(/WE) U$9.1(A14) U$9.14(GND) U$9.20(/CE) U$9.22(/OE) U$9.27(/WE)
HALT: IC128.3(Q1) IC129.11(B:A1) IC147.5(B:I1)
IMM_X_OUT: IC217.1(A:G) IC217.19(B:G)
IMMY_OUT: IC19.1(A:G) IC19.19(B:G)
INT_ACK: IC222.4(G2A) IC222.5(G2B)
INT_ENABLE: IC8.15(B:A3) IC144.5(Q3) IC204.13(A:I2)
INT_PENDING: IC204.12(A:O)
INT_REQ: IC66.5(B:I1)
INT_REQ_0: IC163.3(A:CLK)
INT_REQ_1: IC164.3(A:CLK)
INT_REQ_2: IC168.3(A:CLK)
INT_REQ_3: IC174.3(A:CLK)
INT_REQ_4: IC188.3(A:CLK)
INT_REQ_5: IC221.3(A:CLK)
INT_STATUS_ENCODED_OUT: IC160.19(B:G) IC161.19(B:G)
INTERRUPT_STATUS_OUT: IC156.19(B:G) IC159.19(B:G)
IR_0: IC20.2(Q1) IC35.4(1C2)
IR_1: IC35.12(2C2)
IR_2: IC36.4(1C2)
IR_3: IC36.12(2C2)
IR_4: IC37.4(1C2)
IR_5: IC37.12(2C2)
IR_6: IC38.4(1C2)
IR_7: IC20.19(Q8) IC38.12(2C2)
MARH_WRT: IC7.1(G)
MARH_X_OUT: IC24.19(B:G) IC25.19(B:G)
MARL_0: IC27.11(B:A1) IC28.11(B:A1) IC189.2(1Q)
MARL_1: IC27.13(B:A2) IC28.13(B:A2) IC189.5(2Q)
MARL_WRT: IC189.1(G)
MARL_X_OUT: IC26.19(B:G) IC27.19(B:G)
MASK_0: IC201.9(C:I0) IC244.11(B:A1) IC248.3(Q1)
MASK_1: IC203.9(C:I0) IC244.13(B:A2) IC248.4(Q2)
MASK_2: IC206.9(C:I0) IC244.15(B:A3) IC248.5(Q3)
MASK_3: IC228.9(C:I0) IC244.17(B:A4) IC248.6(Q4)
MASK_4: IC190.9(C:I0) IC247.11(B:A1) IC249.3(Q1)
MASK_5: IC242.9(C:I0) IC247.13(B:A2) IC249.4(Q2)
MASK_ENABLE: IC8.17(B:A4) IC144.6(Q4) IC190.10(C:I1) IC201.10(C:I1) IC203.10(C:I1) IC206.10(C:I1) IC228.10(C:I1) IC242.10(C:I1)
MASK_FLAGS_OUT: IC244.19(B:G) IC247.19(B:G)
MASK_FLAGS_WRT: IC248.1(M) IC248.2(N) IC249.1(M) IC249.2(N)
MDR_IN_BUS0: IC21.3(1D) IC180.3(1D)
MDR_IN_BUS1: IC21.4(2D) IC180.4(2D)
MDR_IN_BUS2: IC21.7(3D) IC180.7(3D)
MDR_IN_BUS3: IC21.8(4D) IC180.8(4D)
MDR_IN_BUS4: IC21.13(5D) IC180.13(5D)
MDR_IN_BUS5: IC21.14(6D) IC180.14(6D)
MDR_IN_BUS6: IC21.17(7D) IC180.17(7D)
MDR_IN_BUS7: IC21.18(8D) IC180.18(8D)
MDR_IN_SRC: IC22.1(!A!/B) IC23.1(!A!/B)
MDRH_DATA_OUT: IC178.1(A:G) IC179.1(A:G)
MDRH_WRT: IC180.1(G)
MDRH_X_OUT: IC176.1(A:G) IC181.1(A:G)
MDRH_Y_OUT: IC182.1(A:G) IC183.1(A:G)
MDRL_DATA_OUT: IC30.1(A:G) IC31.1(A:G)
MDRL_WRT: IC21.1(G)
MDRL_X_OUT: IC12.1(A:G) IC13.1(A:G)
MDRL_Y_OUT: IC10.1(A:G) IC11.1(A:G)
MEM_IO: IC69.5(B:Y3) R10.6
N$1: IC1.2(1Q) IC9.2(A:A1)
N$2: IC1.5(2Q) IC9.4(A:A2)
N$3: IC1.6(3Q) IC9.6(A:A3)
N$4: IC1.9(4Q) IC9.8(A:A4)
N$5: IC1.12(5Q) IC9.11(B:A1)
N$6: IC1.15(6Q) IC9.13(B:A2)
N$7: IC1.16(7Q) IC9.15(B:A3)
N$8: IC1.19(8Q) IC9.17(B:A4)
N$9: IC139.1(M) IC139.2(N) IC147.6(B:O)
N$10: IC80.6(B:O) IC133.2(A:I1)
N$11: IC82.19(8Q) IC95.10(3B) IC104.9(A8)
N$12: IC49.4(1Y) IC50.6(B1)
N$13: IC2.11(B:A1) IC100.2(1Q)
N$14: IC49.7(2Y) IC50.2(B2)
N$15: IC2.13(B:A2) IC100.5(2Q)
N$16: IC2.15(B:A3) IC100.6(3Q)
N$17: IC2.17(B:A4) IC100.9(4Q)
N$18: IC3.11(B:A1) IC100.12(5Q)
N$19: IC3.13(B:A2) IC100.15(6Q)
N$20: IC3.15(B:A3) IC100.16(7Q)
N$21: IC3.17(B:A4) IC100.19(8Q)
N$22: IC56.3(1C3) IC57.2(A:O)
N$23: IC65.2(A:O) IC138.2(A:I1)
N$24: IC143.3(A:O) IC170.5(B:I1)
N$25: IC101.2(1Q) IC102.11(B:A1)
N$26: IC101.5(2Q) IC102.13(B:A2)
N$27: IC101.6(3Q) IC102.15(B:A3)
N$28: IC101.9(4Q) IC102.17(B:A4)
N$29: IC101.12(5Q) IC117.11(B:A1)
N$30: IC101.15(6Q) IC117.13(B:A2)
N$31: IC101.16(7Q) IC117.15(B:A3)
N$32: IC101.19(8Q) IC117.17(B:A4)
N$33: IC56.4(1C2) IC57.1(A:I) IC167.4(1Y)
N$34: IC160.15(B:A3)
N$35: IC49.9(3Y) IC50.15(B3)
N$36: IC49.12(4Y) IC50.11(B4)
N$37: IC51.6(B1) IC55.4(1Y)
N$38: IC51.2(B2) IC55.7(2Y)
N$39: IC51.15(B3) IC55.9(3Y)
N$40: IC51.11(B4) IC55.12(4Y)
N$41: IC160.13(B:A2)
N$42: IC179.2(A:A1) IC180.2(1Q) IC181.2(A:A1) IC182.2(A:A1)
N$43: IC179.4(A:A2) IC180.5(2Q) IC181.4(A:A2) IC182.4(A:A2)
N$44: IC179.6(A:A3) IC180.6(3Q) IC181.6(A:A3) IC182.6(A:A3)
N$45: IC179.8(A:A4) IC180.9(4Q) IC181.8(A:A4) IC182.8(A:A4)
N$46: IC176.2(A:A1) IC178.2(A:A1) IC180.12(5Q) IC183.2(A:A1)
N$47: IC176.4(A:A2) IC178.4(A:A2) IC180.15(6Q) IC183.4(A:A2)
N$48: IC176.6(A:A3) IC178.6(A:A3) IC180.16(7Q) IC183.6(A:A3)
N$49: IC128.4(Q2) IC129.13(B:A2)
N$50: IC130.6(B:O) IC141.1(A:I) IC143.2(A:I1)
N$51: IC176.8(A:A4) IC178.8(A:A4) IC180.19(8Q) IC183.8(A:A4)
N$52: IC27.15(B:A3) IC28.15(B:A3) IC189.6(3Q)
N$53: IC27.17(B:A4) IC28.17(B:A4) IC189.9(4Q)
N$54: IC26.11(B:A1) IC29.11(B:A1) IC189.12(5Q)
N$55: IC26.13(B:A2) IC29.13(B:A2) IC189.15(6Q)
N$56: IC26.15(B:A3) IC29.15(B:A3) IC189.16(7Q)
N$57: IC26.17(B:A4) IC29.17(B:A4) IC189.19(8Q)
N$58: IC7.2(1Q) IC25.11(B:A1) IC70.11(B:A1)
N$59: IC7.5(2Q) IC25.13(B:A2) IC70.13(B:A2)
N$60: IC7.6(3Q) IC25.15(B:A3) IC70.15(B:A3)
N$61: IC7.9(4Q) IC25.17(B:A4) IC70.17(B:A4)
N$62: IC7.12(5Q) IC24.11(B:A1) IC71.11(B:A1)
N$63: IC7.15(6Q) IC24.13(B:A2) IC71.13(B:A2)
N$64: IC7.16(7Q) IC24.15(B:A3) IC71.15(B:A3)
N$65: IC52.6(B1) IC63.4(1Y)
N$66: IC46.19(8Q) IC196.17(B:A4)
N$67: IC5.2(1Q) IC109.11(B:A1)
N$68: IC5.5(2Q) IC109.13(B:A2)
N$69: IC5.6(3Q) IC109.15(B:A3)
N$70: IC5.9(4Q) IC109.17(B:A4)
N$71: IC5.12(5Q) IC110.11(B:A1)
N$72: IC5.15(6Q) IC110.13(B:A2)
N$73: IC7.19(8Q) IC24.17(B:A4) IC71.17(B:A4)
N$74: IC52.2(B2) IC63.7(2Y)
N$75: IC52.15(B3) IC63.9(3Y)
N$76: IC44.3(A:CLK) IC139.7(CLK) SW3.C
N$77: IC75.3(D1) U$1.11(I/O0)
N$78: IC39.1(A:I0) IC43.4(B:O) IC45.1(A:I0)
N$79: IC73.3(1B) IC142.9(2Y)
N$80: IC83.4(B:O)
N$81: IC138.1(A:I0) IC141.2(A:O)
N$82: IC138.3(A:O) IC170.4(B:I0)
N$83: IC10.2(A:A1) IC13.2(A:A1) IC21.2(1Q) IC30.2(A:A1)
N$84: IC133.1(A:I0) IC170.6(B:O)
N$85: IC64.6(A:O) IC65.1(A:I)
N$86: IC64.2(A:I1) IC150.2(A:O)
N$87: IC145.11(B:A1) IC184.2(1Q)
N$88: IC64.1(A:I0) IC151.2(A:O)
N$89: IC131.6(A:O) IC132.1(A:I)
N$90: IC132.2(A:O) IC143.1(A:I0)
N$91: IC14.2(A0) R5.16
N$92: IC14.23(A1) R5.15
N$93: IC14.21(A2) R5.14
N$94: IC14.19(A3) R5.13
N$95: IC15.2(A0) R5.12
N$96: IC15.23(A1) R5.11
N$97: IC15.21(A2) R5.10
N$98: IC15.19(A3) R5.9
N$99: IC14.1(B0) R4.9
N$100: IC14.22(B1) R4.10
N$101: IC14.20(B2) R4.11
N$102: IC14.18(B3) R4.12
N$103: IC11.12(A:Y4) IC15.1(B0) R4.13
N$104: IC11.14(A:Y3) IC15.22(B1) R4.14
N$105: IC11.16(A:Y2) IC15.20(B2) R4.15
N$106: IC11.18(A:Y1) IC15.18(B3) R4.16
N$107: IC14.16(CN+4) IC15.7(CN)
N$108: IC46.4(2D) IC47.7(2Y)
N$109: IC145.13(B:A2) IC184.5(2Q)
N$110: IC131.5(A:I3) IC157.2(A:O)
N$111: IC145.15(B:A3) IC184.6(3Q)
N$112: IC145.17(B:A4) IC184.9(4Q)
N$113: IC131.1(A:I0) IC158.2(A:O)
N$114: IC86.2(1Q) IC89.2(A:A1)
N$115: IC86.5(2Q) IC89.4(A:A2)
N$116: IC86.6(3Q) IC89.6(A:A3)
N$117: IC86.9(4Q) IC89.8(A:A4)
N$118: IC86.12(5Q) IC90.2(A:A1)
N$119: IC86.15(6Q) IC90.4(A:A2)
N$120: IC86.16(7Q) IC90.6(A:A3)
N$121: IC86.19(8Q) IC90.8(A:A4)
N$122: IC88.2(1Q) IC91.2(A:A1)
N$123: IC88.5(2Q) IC91.4(A:A2)
N$124: IC88.6(3Q) IC91.6(A:A3)
N$125: IC88.9(4Q) IC91.8(A:A4)
N$126: IC88.12(5Q) IC92.2(A:A1)
N$127: IC88.15(6Q) IC92.4(A:A2)
N$128: IC88.16(7Q) IC92.6(A:A3)
N$129: IC88.19(8Q) IC92.8(A:A4)
N$130: IC42.2(A:I1) IC67.6(B:O)
N$131: IC93.3(1D) IC96.4(1Y)
N$132: IC10.4(A:A2) IC13.4(A:A2) IC21.5(2Q) IC30.4(A:A2)
N$133: IC45.3(A:O) IC67.5(B:I1)
N$134: IC10.6(A:A3) IC13.6(A:A3) IC21.6(3Q) IC30.6(A:A3)
N$135: IC146.11(B:A1) IC184.12(5Q)
N$136: IC146.13(B:A2) IC184.15(6Q)
N$137: IC10.8(A:A4) IC13.8(A:A4) IC21.9(4Q) IC30.8(A:A4)
N$138: IC11.2(A:A1) IC12.2(A:A1) IC21.12(5Q) IC31.2(A:A1)
N$139: IC146.15(B:A3) IC184.16(7Q)
N$140: IC11.4(A:A2) IC12.4(A:A2) IC21.15(6Q) IC31.4(A:A2)
N$141: IC11.6(A:A3) IC12.6(A:A3) IC21.16(7Q) IC31.6(A:A3)
N$142: IC146.17(B:A4) IC184.19(8Q)
N$143: IC5.16(7Q) IC110.15(B:A3)
N$144: IC52.11(B4) IC63.12(4Y)
N$145: IC53.6(B1) IC68.4(1Y)
N$146: IC5.19(8Q) IC110.17(B:A4)
N$147: IC53.2(B2) IC68.7(2Y)
N$148: IC93.4(2D) IC96.7(2Y)
N$149: IC93.7(3D) IC96.9(3Y)
N$150: IC55.13(4B) IC63.3(1B) IC63.6(2B) IC63.10(3B) IC63.13(4B) IC68.3(1B) IC68.6(2B)
N$151: IC4.2(1Q) IC111.11(B:A1)
N$152: IC49.1(!A!/B) IC55.1(!A!/B) IC63.1(!A!/B) IC68.1(!A!/B) IC85.12(A:O)
N$153: IC45.2(A:I1) IC66.6(B:O)
N$154: IC84.4(B:O)
N$155: IC128.5(Q3) IC129.15(B:A3)
N$156: IC93.8(4D) IC96.12(4Y)
N$157: IC93.13(5D) IC94.4(1Y)
N$158: IC93.14(6D) IC94.7(2Y)
N$159: IC93.17(7D) IC94.9(3Y)
N$160: IC93.18(8D) IC94.12(4Y)
N$161: IC82.3(1D) IC97.4(1Y)
N$162: IC82.4(2D) IC97.7(2Y)
N$163: IC82.7(3D) IC97.9(3Y)
N$164: IC11.8(A:A4) IC12.8(A:A4) IC21.19(8Q) IC31.8(A:A4)
N$165: IC82.8(4D) IC97.12(4Y)
N$166: IC82.13(5D) IC95.4(1Y)
N$167: SW3.2
N$168: IC82.14(6D) IC95.7(2Y)
N$169: IC10.18(A:Y1)
N$170: IC10.16(A:Y2)
N$171: IC10.14(A:Y3)
N$172: IC10.12(A:Y4)
N$173: IC82.17(7D) IC95.9(3Y)
N$174: R7.9 SW1.8
N$175: IC47.5(2A) IC58.3(A:O)
N$176: IC14.7(CN) IC56.7(1Y)
N$177: IC13.18(A:Y1)
N$178: IC13.16(A:Y2)
N$179: IC13.14(A:Y3)
N$180: IC13.12(A:Y4)
N$181: IC12.18(A:Y1)
N$182: IC12.16(A:Y2)
N$183: IC12.14(A:Y3)
N$184: IC12.12(A:Y4)
N$185: IC47.2(1A) IC119.4(1Y)
N$186: R7.10 SW1.7
N$187: R7.11 SW1.6
N$188: R7.12 SW1.5
N$189: R7.13 SW1.4
N$190: R7.14 SW1.3
N$191: IC22.7(2Y)
N$192: IC22.9(3Y)
N$193: IC22.12(4Y)
N$194: IC23.4(1Y)
N$195: IC23.7(2Y)
N$196: IC23.9(3Y)
N$197: IC23.12(4Y)
N$198: IC22.3(1B)
N$199: IC22.6(2B)
N$200: IC30.18(A:Y1)
N$201: IC30.16(A:Y2)
N$202: IC82.18(8D) IC95.12(4Y)
N$203: IC30.14(A:Y3)
N$204: IC30.12(A:Y4)
N$205: IC82.16(7Q) IC95.6(2B) IC104.8(A7)
N$206: IC31.18(A:Y1)
N$207: IC31.16(A:Y2)
N$208: IC31.14(A:Y3)
N$209: IC31.12(A:Y4)
N$210: IC22.4(1Y)
N$211: IC22.10(3B)
N$212: IC22.13(4B)
N$213: IC23.3(1B)
N$214: IC23.6(2B)
N$215: IC23.10(3B)
N$216: IC23.13(4B)
N$217: IC128.6(Q4) IC129.17(B:A4)
N$218: IC46.7(3D) IC47.9(3Y)
N$219: IC46.8(4D) IC47.12(4Y)
N$220: R7.15 SW1.2
N$221: IC122.11(B:A1) IC123.12(5Q)
N$222: R6.8 SW2.1
N$223: R6.7 SW2.2
N$224: R6.6 SW2.3
N$225: R6.5 SW2.4
N$226: R6.4 SW2.5
N$227: R6.3 SW2.6
N$228: R6.2 SW2.7
N$229: IC122.13(B:A2) IC123.15(6Q)
N$230: IC122.15(B:A3) IC123.16(7Q)
N$231: IC119.3(1B) IC120.3(A:O)
N$232: IC82.15(6Q) IC95.3(1B) IC104.7(A6)
N$233: IC82.12(5Q) IC97.13(4B) IC104.6(A5)
N$235: IC122.17(B:A4) IC123.19(8Q)
N$236: IC122.2(A:A1) IC123.2(1Q)
N$237: IC122.4(A:A2) IC123.5(2Q)
N$238: IC122.6(A:A3) IC123.6(3Q)
N$239: IC32.3(D1) IC41.7(1Y)
N$240: IC32.11(CLK) IC33.11(CLK)
N$241: IC32.1(CLR) IC33.1(CLR)
N$242: IC32.4(D2) IC41.9(2Y)
N$243: IC32.7(D3) IC40.7(1Y)
N$244: IC32.8(D4) IC40.9(2Y)
N$245: IC32.13(D5) IC34.7(1Y)
N$246: IC32.14(D6) IC34.9(2Y)
N$247: IC33.3(D1) IC35.7(1Y)
N$248: IC33.4(D2) IC35.9(2Y)
N$249: IC122.8(A:A4) IC123.9(4Q)
N$250: IC33.7(D3) IC36.7(1Y)
N$251: U$2.10(A0)
N$252: U$2.9(A1)
N$253: U$2.8(A2)
N$254: U$2.7(A3)
N$255: U$2.6(A4)
N$256: U$2.5(A5)
N$257: U$2.4(A6)
N$258: U$2.3(A7)
N$259: U$2.25(A8)
N$260: U$2.24(A9)
N$261: U$2.21(A10)
N$262: U$2.23(A11)
N$263: U$2.2(A12)
N$264: U$2.26(A13)
N$265: U$3.10(A0)
N$266: U$3.9(A1)
N$267: U$3.8(A2)
N$268: U$3.7(A3)
N$269: U$3.6(A4)
N$270: U$3.5(A5)
N$271: U$3.4(A6)
N$272: U$3.3(A7)
N$273: U$3.25(A8)
N$274: U$3.24(A9)
N$275: U$3.21(A10)
N$276: U$3.23(A11)
N$277: U$3.2(A12)
N$278: U$3.26(A13)
N$279: U$4.10(A0)
N$280: U$4.9(A1)
N$281: U$4.8(A2)
N$282: U$4.7(A3)
N$283: U$4.6(A4)
N$284: U$4.5(A5)
N$285: U$4.4(A6)
N$286: U$4.3(A7)
N$287: U$4.25(A8)
N$288: U$4.24(A9)
N$289: U$4.21(A10)
N$290: U$4.23(A11)
N$291: U$4.2(A12)
N$292: U$4.26(A13)
N$293: U$5.10(A0)
N$294: U$5.9(A1)
N$295: U$5.8(A2)
N$296: U$5.7(A3)
N$297: U$5.6(A4)
N$298: U$5.5(A5)
N$299: U$5.4(A6)
N$300: U$5.3(A7)
N$301: U$5.25(A8)
N$302: U$5.24(A9)
N$303: U$5.21(A10)
N$304: U$5.23(A11)
N$305: U$5.2(A12)
N$306: U$5.26(A13)
N$307: IC33.8(D4) IC36.9(2Y)
N$308: IC33.13(D5) IC37.7(1Y)
N$309: IC33.14(D6) IC37.9(2Y)
N$310: IC33.17(D7) IC38.7(1Y)
N$311: IC33.18(D8) IC38.9(2Y)
N$312: IC82.9(4Q) IC97.10(3B) IC104.5(A4)
N$313: IC82.6(3Q) IC97.6(2B) IC104.4(A3)
N$314: IC82.5(2Q) IC97.3(1B) IC104.3(A2)
N$315: IC82.2(1Q) IC94.13(4B) IC104.2(A1)
N$316: IC93.19(8Q) IC94.10(3B) IC103.9(A8)
N$317: IC93.16(7Q) IC94.6(2B) IC103.8(A7)
N$318: IC93.15(6Q) IC94.3(1B) IC103.7(A6)
N$319: IC93.12(5Q) IC96.13(4B) IC103.6(A5)
N$320: IC226.9(A0)
N$321: IC93.9(4Q) IC96.10(3B) IC103.5(A4)
N$322: IC175.6(B:O) IC177.4(B:I0)
N$323: IC93.6(3Q) IC96.6(2B) IC103.4(A3)
N$324: IC177.6(B:O) IC192.4(B:I0)
N$325: IC124.11(B:A1) IC153.2(1Q)
N$326: IC124.13(B:A2) IC153.5(2Q)
N$327: IC124.15(B:A3) IC153.6(3Q)
N$328: IC124.17(B:A4) IC153.9(4Q)
N$329: IC125.11(B:A1) IC153.12(5Q)
N$330: IC125.13(B:A2) IC153.15(6Q)
N$331: IC125.15(B:A3) IC153.16(7Q)
N$332: IC125.17(B:A4) IC153.19(8Q)
N$333: IC50.5(A1)
N$334: IC50.3(A2)
N$335: IC50.14(A3)
N$336: IC50.12(A4)
N$337: IC52.5(A1)
N$338: IC51.5(A1)
N$339: IC51.3(A2)
N$340: IC51.14(A3)
N$341: IC51.12(A4)
N$342: IC154.11(B:A1) IC185.2(1Q)
N$343: IC93.5(2Q) IC96.3(1B) IC103.3(A2)
N$344: IC93.2(1Q) IC103.2(A1)
N$345: IC121.4(1Y) IC126.3(1D)
N$346: IC190.8(C:O) IC191.1(A:I0)
N$347: IC121.3(1B) IC127.3(A:O)
N$348: IC148.3(B:I) IC156.11(B:A1) IC162.2(Q1)
N$349: IC149.3(B:I) IC226.14(GS)
N$350: IC52.3(A2)
N$351: IC52.14(A3)
N$352: IC52.12(A4)
N$353: IC53.5(A1)
N$354: IC53.3(A2)
N$355: IC191.3(A:O) IC226.11
N$356: IC149.4(B:O) IC204.2(A:I1)
N$357: IC50.9(C4) IC51.7(C0)
N$358: IC51.9(C4) IC52.7(C0)
N$359: IC52.9(C4) IC53.7(C0)
N$360: IC76.5(Q2)
N$361: IC204.1(A:I0) IC226.15(EO)
N$362: IC192.6(B:O) IC193.4(B:I0)
N$363: IC148.4(B:O) IC226.4
N$364: IC76.6(Q3)
N$365: IC152.4(B:O) IC226.3
N$366: IC152.3(B:I) IC156.13(B:A2) IC162.5(Q2)
N$367: IC75.4(D2) U$1.12(I/O1)
N$368: IC201.8(C:O) IC202.1(A:I0)
N$369: IC75.7(D3) U$1.13(I/O2)
N$370: IC46.3(1D) IC47.4(1Y)
N$371: IC15.16(CN+4) IC58.2(A:I1)
N$372: IC168.1(A:CLR) IC220.3(A:O)
N$373: IC154.13(B:A2) IC185.5(2Q)
N$374: IC174.1(A:CLR) IC223.3(A:O)
N$375: IC75.8(D4) U$1.15(I/O3)
N$376: IC75.13(D5) U$1.16(I/O4)
N$377: IC75.14(D6) U$1.17(I/O5)
N$378: IC60.3(D1) U$10.11(I/O0)
N$379: IC60.4(D2) U$10.12(I/O1)
N$380: IC60.7(D3) U$10.13(I/O2)
N$381: IC60.8(D4) U$10.15(I/O3)
N$382: IC60.13(D5) U$10.16(I/O4)
N$383: IC60.14(D6) U$10.17(I/O5)
N$384: IC60.17(D7) U$10.18(I/O6)
N$385: IC60.18(D8) U$10.19(I/O7)
N$386: IC61.3(D1) U$11.11(I/O0)
N$387: IC61.4(D2) U$11.12(I/O1)
N$388: IC188.1(A:CLR) IC224.3(A:O)
N$389: IC162.3(D1) IC207.3(A:O)
N$390: IC162.7(D3) IC163.5(A:Q)
N$391: IC76.9(Q4)
N$392: IC162.8(D4) IC164.5(A:Q)
N$393: IC162.13(D5) IC168.5(A:Q)
N$394: IC162.14(D6) IC174.5(A:Q)
N$395: IC162.17(D7) IC188.5(A:Q)
N$396: IC162.18(D8) IC221.5(A:Q)
N$397: IC208.2(A:I1) IC222.15(Y0)
N$398: IC218.2(A:I1) IC222.13(Y2)
N$399: IC219.2(A:I1) IC222.12(Y3)
N$400: IC76.12(Q5)
N$401: IC76.15(Q6)
N$402: IC76.16(Q7)
N$403: IC222.10(Y5) IC223.1(A:I0)
N$404: IC4.5(2Q) IC111.13(B:A2)
N$405: IC222.7(Y7) IC225.1(A:I0)
N$406: IC187.5(A:Q) IC207.2(A:I1)
N$407: IC187.1(A:CLR) IC208.3(A:O)
N$408: IC163.1(A:CLR) IC218.3(A:O)
N$409: IC164.1(A:CLR) IC219.3(A:O)
N$410: IC221.1(A:CLR) IC225.3(A:O)
N$411: IC156.15(B:A3) IC162.6(Q3) IC202.2(A:I1)
N$412: IC156.17(B:A4) IC162.9(Q4) IC205.2(A:I1)
N$413: IC202.3(A:O) IC226.2
N$414: IC159.11(B:A1) IC162.12(Q5) IC227.2(A:I1)
N$415: IC203.8(C:O) IC205.1(A:I0)
N$416: IC205.3(A:O) IC226.1
N$417: IC206.8(C:O) IC227.1(A:I0)
N$418: IC226.13 IC227.3(A:O)
N$419: IC228.8(C:O) IC241.1(A:I0)
N$420: IC226.12 IC241.3(A:O)
N$421: IC242.8(C:O) IC243.1(A:I0)
N$422: IC154.15(B:A3) IC185.6(3Q)
N$423: IC154.17(B:A4) IC185.9(4Q)
N$424: IC155.11(B:A1) IC185.12(5Q)
N$425: IC155.13(B:A2) IC185.15(6Q)
N$426: IC155.15(B:A3) IC185.16(7Q)
N$427: IC155.17(B:A4) IC185.19(8Q)
N$428: IC186.11(B:A1) IC216.2(1Q)
N$429: IC186.13(B:A2) IC216.5(2Q)
N$430: IC186.15(B:A3) IC216.6(3Q)
N$431: IC186.17(B:A4) IC216.9(4Q)
N$432: IC215.11(B:A1) IC216.12(5Q)
N$433: IC215.13(B:A2) IC216.15(6Q)
N$434: IC215.15(B:A3) IC216.16(7Q)
N$435: IC215.17(B:A4) IC216.19(8Q)
N$436: IC226.10 IC243.3(A:O)
N$437: IC159.13(B:A2) IC162.15(Q6) IC241.2(A:I1)
N$438: IC159.15(B:A3) IC162.16(Q7) IC191.2(A:I1)
N$439: IC159.17(B:A4) IC162.19(Q8) IC243.2(A:I1)
N$440: IC76.19(Q8)
N$441: IC247.15(B:A3) IC249.5(Q3)
N$442: IC76.3(D1) U$2.11(I/O0)
N$443: IC76.4(D2) U$2.12(I/O1)
N$444: IC247.17(B:A4) IC249.6(Q4)
N$445: IC193.6(B:O) IC194.4(B:I0)
N$446: IC197.5(A:O) IC198.1(A:I)
N$447: IC77.5(Q2)
N$448: IC61.7(D3) U$11.13(I/O2)
N$449: IC75.17(D7) U$1.18(I/O6)
N$450: IC75.18(D8) U$1.19(I/O7)
N$451: IC76.7(D3) U$2.13(I/O2)
N$452: IC76.8(D4) U$2.15(I/O3)
N$453: IC76.13(D5) U$2.16(I/O4)
N$454: IC76.14(D6) U$2.17(I/O5)
N$455: IC76.17(D7) U$2.18(I/O6)
N$456: IC76.18(D8) U$2.19(I/O7)
N$457: IC77.3(D1) U$3.11(I/O0)
N$458: IC77.4(D2) U$3.12(I/O1)
N$459: IC77.7(D3) U$3.13(I/O2)
N$460: IC77.8(D4) U$3.15(I/O3)
N$461: IC77.13(D5) U$3.16(I/O4)
N$462: IC77.14(D6) U$3.17(I/O5)
N$463: IC77.17(D7) U$3.18(I/O6)
N$464: IC77.18(D8) U$3.19(I/O7)
N$465: IC78.3(D1) U$4.11(I/O0)
N$466: IC78.4(D2) U$4.12(I/O1)
N$467: IC78.7(D3) U$4.13(I/O2)
N$468: IC78.8(D4) U$4.15(I/O3)
N$469: IC78.13(D5) U$4.16(I/O4)
N$470: IC78.14(D6) U$4.17(I/O5)
N$471: IC78.17(D7) U$4.18(I/O6)
N$472: IC78.18(D8) U$4.19(I/O7)
N$473: IC79.3(D1) U$5.11(I/O0)
N$474: IC79.4(D2) U$5.12(I/O1)
N$475: IC79.7(D3) U$5.13(I/O2)
N$476: IC79.8(D4) U$5.15(I/O3)
N$477: IC79.13(D5) U$5.16(I/O4)
N$478: IC79.14(D6) U$5.17(I/O5)
N$479: IC79.17(D7) U$5.18(I/O6)
N$480: IC79.18(D8) U$5.19(I/O7)
N$481: IC198.2(A:O) IC199.1(A:I0)
N$482: IC61.8(D4) U$11.15(I/O3)
N$483: IC61.13(D5) U$11.16(I/O4)
N$484: IC61.14(D6) U$11.17(I/O5)
N$485: IC61.17(D7) U$11.18(I/O6)
N$486: IC61.18(D8) U$11.19(I/O7)
N$487: IC62.3(D1) U$12.11(I/O0)
N$488: IC62.4(D2) U$12.12(I/O1)
N$489: IC62.7(D3) U$12.13(I/O2)
N$490: IC62.8(D4) U$12.15(I/O3)
N$491: IC62.13(D5) U$12.16(I/O4)
N$492: IC62.14(D6) U$12.17(I/O5)
N$493: IC62.17(D7) U$12.18(I/O6)
N$494: IC62.18(D8) U$12.19(I/O7)
N$495: IC194.6(B:O) IC200.4(B:I0)
N$496: IC200.6(B:O) IC209.4(B:I0)
N$497: IC46.13(5D) IC210.4(1Y)
N$498: IC46.14(6D) IC210.7(2Y)
N$499: IC46.17(7D) IC210.9(3Y)
N$500: IC46.18(8D) IC210.12(4Y)
N$503: IC134.18(D8) U$6.19(I/O7)
N$504: IC134.17(D7) U$6.18(I/O6)
N$505: IC134.14(D6) U$6.17(I/O5)
N$506: IC134.13(D5) U$6.16(I/O4)
N$507: IC134.8(D4) U$6.15(I/O3)
N$508: IC134.7(D3) U$6.13(I/O2)
N$509: IC134.4(D2) U$6.12(I/O1)
N$510: IC134.3(D1) U$6.11(I/O0)
N$511: IC135.3(D1) U$7.11(I/O0)
N$512: IC135.4(D2) U$7.12(I/O1)
N$513: IC135.7(D3) U$7.13(I/O2)
N$514: IC135.8(D4) U$7.15(I/O3)
N$515: IC135.13(D5) U$7.16(I/O4)
N$516: IC135.14(D6) U$7.17(I/O5)
N$517: IC135.17(D7) U$7.18(I/O6)
N$518: IC135.18(D8) U$7.19(I/O7)
N$519: IC136.3(D1) U$8.11(I/O0)
N$520: IC136.4(D2) U$8.12(I/O1)
N$521: IC136.7(D3) U$8.13(I/O2)
N$522: IC136.8(D4) U$8.15(I/O3)
N$523: IC136.13(D5) U$8.16(I/O4)
N$524: IC136.14(D6) U$8.17(I/O5)
N$525: IC136.17(D7) U$8.18(I/O6)
N$526: IC136.18(D8) U$8.19(I/O7)
N$527: IC137.3(D1) U$9.11(I/O0)
N$528: IC87.3(A:S2) R1.1 S1.1(O)
N$529: IC87.1(A:R) R2.1 S1.3(S)
N$531: IC87.4(A:Q) SW3.1
N$532: SW3.4
N$533: IC137.4(D2) U$9.12(I/O1)
N$534: IC137.7(D3) U$9.13(I/O2)
N$535: IC137.8(D4) U$9.15(I/O3)
N$536: IC137.13(D5) U$9.16(I/O4)
N$537: IC137.14(D6) U$9.17(I/O5)
N$538: IC137.17(D7) U$9.18(I/O6)
N$539: IC137.18(D8) U$9.19(I/O7)
N$548: IC57.3(B:I) IC139.3(Q1)
N$558: IC73.2(1A) IC142.7(1Y)
N$564: IC77.6(Q3)
N$567: IC81.6(B:O) IC142.12(2C2)
N$568: IC77.9(Q4)
N$569: IC18.6(B:O) IC142.13(2C3)
N$571: IC77.12(Q5)
N$574: IC16.2(1Q) IC211.2(A:A1)
N$575: IC16.5(2Q) IC211.4(A:A2)
N$576: IC16.6(3Q) IC211.6(A:A3)
N$577: IC4.6(3Q) IC111.15(B:A3)
N$578: IC4.9(4Q) IC111.17(B:A4)
N$579: IC4.12(5Q) IC112.11(B:A1)
N$580: IC4.15(6Q) IC112.13(B:A2)
N$581: IC4.16(7Q) IC112.15(B:A3)
N$582: IC4.19(8Q) IC112.17(B:A4)
N$583: IC98.2(1Q) IC113.11(B:A1)
N$584: IC98.5(2Q) IC113.13(B:A2)
N$585: IC98.6(3Q) IC113.15(B:A3)
N$586: IC98.9(4Q) IC113.17(B:A4)
N$587: IC98.12(5Q) IC114.11(B:A1)
N$588: IC98.15(6Q) IC114.13(B:A2)
N$589: IC98.16(7Q) IC114.15(B:A3)
N$590: IC98.19(8Q) IC114.17(B:A4)
N$591: IC99.2(1Q) IC115.11(B:A1)
N$592: IC99.5(2Q) IC115.13(B:A2)
N$593: IC99.6(3Q) IC115.15(B:A3)
N$594: IC99.9(4Q) IC115.17(B:A4)
N$595: IC99.12(5Q) IC116.11(B:A1)
N$596: IC99.15(6Q) IC116.13(B:A2)
N$597: IC99.16(7Q) IC116.15(B:A3)
N$598: IC99.19(8Q) IC116.17(B:A4)
N$601: IC16.9(4Q) IC211.8(A:A4)
N$602: IC77.15(Q6)
N$603: IC16.12(5Q) IC212.2(A:A1)
N$604: IC16.15(6Q) IC212.4(A:A2)
N$605: IC77.16(Q7)
N$606: IC77.19(Q8)
N$607: IC78.2(Q1)
N$608: IC78.5(Q2)
N$609: IC78.6(Q3)
N$610: IC78.9(Q4)
N$611: IC78.12(Q5)
N$612: IC78.15(Q6)
N$613: IC78.16(Q7)
N$614: IC78.19(Q8)
N$615: IC79.2(Q1)
N$616: IC79.5(Q2)
N$617: IC79.6(Q3)
N$618: IC79.9(Q4)
N$619: IC79.12(Q5)
N$620: IC79.15(Q6)
N$621: IC79.16(Q7)
N$622: IC79.19(Q8)
N$623: IC134.2(Q1)
N$624: IC134.5(Q2)
N$625: IC134.6(Q3)
N$626: IC134.9(Q4)
N$627: IC134.12(Q5)
N$628: IC134.15(Q6)
N$629: IC134.16(Q7)
N$630: IC134.19(Q8)
N$631: IC135.2(Q1)
N$632: IC135.5(Q2)
N$633: IC135.6(Q3)
N$634: IC135.9(Q4)
N$635: IC135.12(Q5)
N$636: IC135.15(Q6)
N$637: IC135.16(Q7)
N$638: IC135.19(Q8)
N$639: IC136.2(Q1)
N$640: IC136.5(Q2)
N$641: IC136.6(Q3)
N$642: IC136.9(Q4)
N$643: IC136.12(Q5)
N$644: IC136.15(Q6)
N$645: IC136.16(Q7)
N$646: IC136.19(Q8)
N$647: IC137.2(Q1)
N$648: IC137.5(Q2)
N$649: IC137.6(Q3)
N$650: IC137.9(Q4)
N$651: IC137.12(Q5)
N$652: IC137.15(Q6)
N$653: IC137.16(Q7)
N$654: IC137.19(Q8)
N$655: IC16.16(7Q) IC212.6(A:A3)
N$656: IC16.19(8Q) IC212.8(A:A4)
N$657: IC17.2(1Q) IC213.2(A:A1)
N$658: IC17.5(2Q) IC213.4(A:A2)
N$659: IC17.6(3Q) IC213.6(A:A3)
N$660: IC17.9(4Q) IC213.8(A:A4)
N$661: IC17.12(5Q) IC214.2(A:A1)
N$662: IC17.15(6Q) IC214.4(A:A2)
N$663: IC17.16(7Q) IC214.6(A:A3)
N$664: IC17.19(8Q) IC214.8(A:A4)
N$685: IC220.1(A:I0) IC222.11(Y4)
N$686: IC14.9(F0) IC245.2(A:A1)
N$687: IC222.9(Y6) IC224.1(A:I0)
N$688: IC229.2(A:A1) IC234.2(1Q)
N$689: IC229.4(A:A2) IC234.5(2Q)
N$690: IC229.6(A:A3) IC234.6(3Q)
N$691: IC230.2(A:A1) IC234.12(5Q)
N$692: IC230.4(A:A2) IC234.15(6Q)
N$693: IC230.6(A:A3) IC234.16(7Q)
N$694: IC230.8(A:A4) IC234.19(8Q)
N$695: IC231.2(A:A1) IC233.2(1Q)
N$696: IC231.4(A:A2) IC233.5(2Q)
N$697: IC231.6(A:A3) IC233.6(3Q)
N$698: IC231.8(A:A4) IC233.9(4Q)
N$699: IC232.2(A:A1) IC233.12(5Q)
N$700: IC232.4(A:A2) IC233.15(6Q)
N$701: IC232.6(A:A3) IC233.16(7Q)
N$702: IC232.8(A:A4) IC233.19(8Q)
N$703: IC230.1(A:G)
N$704: IC234.9(4Q)
N$705: IC235.2(A:A1) IC240.2(1Q)
N$706: IC235.4(A:A2) IC240.5(2Q)
N$707: IC235.6(A:A3) IC240.6(3Q)
N$708: IC236.2(A:A1) IC240.12(5Q)
N$709: IC236.4(A:A2) IC240.15(6Q)
N$710: IC236.6(A:A3) IC240.16(7Q)
N$711: IC236.8(A:A4) IC240.19(8Q)
N$712: IC237.2(A:A1) IC239.2(1Q)
N$713: IC237.4(A:A2) IC239.5(2Q)
N$714: IC237.6(A:A3) IC239.6(3Q)
N$715: IC237.8(A:A4) IC239.9(4Q)
N$716: IC238.2(A:A1) IC239.12(5Q)
N$717: IC238.4(A:A2) IC239.15(6Q)
N$718: IC238.6(A:A3) IC239.16(7Q)
N$719: IC238.8(A:A4) IC239.19(8Q)
N$720: IC236.1(A:G)
N$721: IC240.9(4Q)
NOT_CONDITION: IC74.4(B:I0)
NOT_RST: IC20.1(CLR) IC75.1(CLR) IC76.1(CLR) IC77.1(CLR) IC78.1(CLR) IC79.1(CLR) IC134.1(CLR) IC135.1(CLR) IC136.1(CLR) IC137.1(CLR)
OF: IC46.9(4Q) IC59.14(4A) IC195.17(B:A4)
OF_FROM_ALU: IC47.14(4A) IC126.8(4D)
PANEL_MEM_IO: R10.11
PANEL_RD: R10.9
PANEL_WR: R10.10
PCH_0: IC6.2(1Q) IC107.11(B:A1)
PCH_1: IC6.5(2Q) IC107.13(B:A2)
PCH_2: IC6.6(3Q) IC107.15(B:A3)
PCH_3: IC6.9(4Q) IC107.17(B:A4)
PCH_4: IC6.12(5Q) IC108.11(B:A1)
PCH_5: IC6.15(6Q) IC108.13(B:A2)
PCH_6: IC6.16(7Q) IC108.15(B:A3)
PCH_7: IC6.19(8Q) IC108.17(B:A4)
PCH_OUT: IC107.19(B:G) IC108.19(B:G)
PCH_WRT: IC6.1(G)
PCL_0: IC48.2(1Q) IC105.11(B:A1)
PCL_1: IC48.5(2Q) IC105.13(B:A2)
PCL_2: IC48.6(3Q) IC105.15(B:A3)
PCL_3: IC48.9(4Q) IC105.17(B:A4)
PCL_4: IC48.12(5Q) IC106.11(B:A1)
PCL_5: IC48.15(6Q) IC106.13(B:A2)
PCL_6: IC48.16(7Q) IC106.15(B:A3)
PCL_7: IC48.19(8Q) IC106.17(B:A4)
PCL_OUT: IC105.19(B:G) IC106.19(B:G)
PCL_WRT: IC48.1(G)
PF: IC46.12(5Q) IC142.10(2C0) IC196.11(B:A1)
PF_FROM_ALU: IC209.6(B:O) IC210.2(1A)
PROG_MODE: IC250.5(B:I1)
R_SHIFT_H_OUT: IC104.1(G1) IC104.19(G2)
R_SHIFT_H_WRT: IC82.1(G)
R_SHIFT_IN_SRC: IC94.1(!A!/B) IC95.1(!A!/B) IC96.1(!A!/B) IC97.1(!A!/B)
R_SHIFT_L_OUT: IC103.1(G1) IC103.19(G2)
R_SHIFT_L_WRT: IC93.1(G)
RD: IC69.9(B:Y1) R10.8
REQ_ENCOD_0: IC160.11(B:A1) IC222.1(A)
REQ_ENCOD_1: IC222.2(B) IC226.7(A1)
REQ_ENCOD_2: IC222.3(C) IC226.6(A2)
RST: IC54.3(B:I) IC128.15(CLR) IC139.15(CLR) IC144.15(CLR) IC248.15(CLR) IC249.15(CLR) R3.1 S2.2(P)
SF: IC46.6(3Q) IC59.11(3A) IC195.15(B:A3)
SF_FROM_ALU: IC126.7(3D)
SF_XOR_OF: IC72.6(B:O) IC81.4(B:I0) IC142.11(2C1)
SPH_OUT: IC111.19(B:G) IC112.19(B:G)
SPH_WRT: IC4.1(G)
SPL_OUT: IC109.19(B:G) IC110.19(B:G)
SPL_WRT: IC5.1(G)
STOP_CLK: IC44.2(A:D) IC44.5(A:Q) IC147.4(B:I0) R9.1 S4.2(P)
TDR0_H_WRT: IC239.1(G)
TDR0_H_X_OUT: IC237.1(A:G) IC238.1(A:G)
TDR0_L_WRT: IC240.1(G)
TDR0_L_X_OUT: IC235.8(A:A4)
TDR0H_WRT: IC17.1(G)
TDR0H_Y_OUT: IC213.1(A:G) IC214.1(A:G)
TDR0L_OUT3: IC229.1(A:G)
TDR0L_OUT4: IC235.1(A:G)
TDR0L_WRT: IC16.1(G)
TDR0L_Y_OUT: IC211.1(A:G) IC212.1(A:G)
TDR1_H_WRT: IC233.1(G)
TDR1_H_X_OUT: IC231.1(A:G) IC232.1(A:G)
TDR1_L_WRT: IC234.1(G)
TDR1_L_X_OUT: IC229.8(A:A4)
TDR1H_WRT: IC88.1(G)
TDR1H_Y_OUT: IC91.1(A:G) IC92.1(A:G)
TDR1L_WRT: IC86.1(G)
TDR1L_Y_OUT: IC89.1(A:G) IC90.1(A:G)
TRAP_IN: IC187.3(A:CLK) IC207.1(A:I0)
TYP_0: IC43.3(B:I) IC67.4(B:I0)
TYP_1: IC39.2(A:I1) IC42.1(A:I0) IC84.3(B:I)
U_AD0: IC32.2(Q1) IC140.2(A1) IC166.2(A1) U$6.10(A0) U$7.10(A0) U$8.10(A0) U$9.10(A0)
U_AD1: IC32.5(Q2) IC140.3(A2) IC166.3(A2) U$6.9(A1) U$7.9(A1) U$8.9(A1) U$9.9(A1)
U_AD2: IC32.6(Q3) IC140.4(A3) U$6.8(A2) U$7.8(A2) U$8.8(A2) U$9.8(A2)
U_AD3: IC32.9(Q4) IC140.5(A4) U$6.7(A3) U$7.7(A3) U$8.7(A3) U$9.7(A3)
U_AD4: IC32.12(Q5) IC140.6(A5) U$6.6(A4) U$7.6(A4) U$8.6(A4) U$9.6(A4)
U_AD5: IC32.15(Q6) IC140.7(A6) U$6.5(A5) U$7.5(A5) U$8.5(A5) U$9.5(A5)
U_AD6: IC32.16(Q7) IC140.8(A7) U$6.4(A6) U$7.4(A6) U$8.4(A6) U$9.4(A6)
U_AD7: IC32.19(Q8) IC140.9(A8) U$6.3(A7) U$7.3(A7) U$8.3(A7) U$9.3(A7)
U_AD8: IC33.2(Q1) U$6.25(A8) U$7.25(A8) U$8.25(A8) U$9.25(A8)
U_AD9: IC33.5(Q2) IC118.2(A1) IC118.3(A2) U$6.24(A9) U$7.24(A9) U$8.24(A9) U$9.24(A9)
U_AD10: IC33.6(Q3) IC118.4(A3) U$6.21(A10) U$7.21(A10) U$8.21(A10) U$9.21(A10)
U_AD11: IC33.9(Q4) IC118.5(A4) U$6.23(A11) U$7.23(A11) U$8.23(A11) U$9.23(A11)
U_AD12: IC33.12(Q5) IC118.6(A5) U$6.2(A12) U$7.2(A12) U$8.2(A12) U$9.2(A12)
U_AD13: IC33.15(Q6) IC118.7(A6) U$6.26(A13) U$7.26(A13) U$8.26(A13) U$9.26(A13)
U_AD_BUFF0: IC140.18(Y1) U$1.10(A0)
U_AD_BUFF1: IC140.17(Y2) U$1.9(A1)
U_AD_BUFF2: IC140.16(Y3) U$1.8(A2)
U_AD_BUFF3: IC140.15(Y4) U$1.7(A3)
U_AD_BUFF4: IC140.14(Y5) U$1.6(A4)
U_AD_BUFF5: IC140.13(Y6) U$1.5(A5)
U_AD_BUFF6: IC140.12(Y7) U$1.4(A6)
U_AD_BUFF7: IC140.11(Y8) U$1.3(A7)
U_AD_BUFF8: IC118.18(Y1) U$1.25(A8)
U_AD_BUFF9: IC118.17(Y2) U$1.24(A9)
U_AD_BUFF10: IC118.16(Y3) U$1.21(A10)
U_AD_BUFF11: IC118.15(Y4) U$1.23(A11)
U_AD_BUFF12: IC118.14(Y5) U$1.2(A12)
U_AD_BUFF13: IC118.13(Y6) U$1.26(A13)
U_ADDER_0: IC41.6(1C0) IC50.4(S1)
U_ADDER_1: IC41.10(2C0)
U_ADDER_2: IC40.6(1C0)
U_ADDER_3: IC40.10(2C0)
U_ADDER_4: IC34.6(1C0)
U_ADDER_5: IC34.10(2C0)
U_ADDER_6: IC35.6(1C0)
U_ADDER_7: IC35.10(2C0)
U_ADDER_8: IC36.6(1C0)
U_ADDER_9: IC36.10(2C0)
U_ADDER_10: IC37.6(1C0)
U_ADDER_11: IC37.10(2C0)
U_ADDER_12: IC38.6(1C0)
U_ADDER_13: IC38.10(2C0) IC53.1(S2)
U_ADDR_BUFF1_0: IC166.18(Y1)
U_ADDR_BUFF1_1: IC166.17(Y2)
U_ADDR_BUFF1_13: IC165.13(Y6)
U_ADDR_MUX_0: IC34.14(A) IC35.14(A) IC36.14(A) IC37.14(A) IC38.14(A) IC39.3(A:O) IC40.14(A) IC41.14(A)
U_ADDR_MUX_1: IC34.2(B) IC35.2(B) IC36.2(B) IC37.2(B) IC38.2(B) IC40.2(B) IC41.2(B) IC42.3(A:O)
U_CF: IC59.6(2B) IC126.5(2Q) IC167.3(1B)
U_DMA_ADDR_0: IC173.3(1B)
U_DMA_ADDR_1: IC173.6(2B)
U_DMA_ADDR_2: IC173.10(3B)
U_DMA_ADDR_3: IC173.13(4B)
U_DMA_ADDR_4: IC169.3(1B)
U_DMA_ADDR_5: IC169.6(2B)
U_DMA_ADDR_6: IC169.10(3B)
U_DMA_ADDR_7: IC169.13(4B)
U_DMA_ADDR_8: IC171.3(1B)
U_DMA_ADDR_9: IC171.6(2B)
U_DMA_ADDR_10: IC171.10(3B)
U_DMA_ADDR_11: IC171.13(4B)
U_DMA_ADDR_12: IC172.3(1B)
U_DMA_ADDR_13: IC172.6(2B)
U_FETCH_0: IC41.5(1C1) R7.16 SW1.1
U_FETCH_1: IC41.11(2C1)
U_FETCH_2: IC40.5(1C1)
U_FETCH_3: IC40.11(2C1)
U_FETCH_4: IC34.5(1C1)
U_FETCH_5: IC34.11(2C1)
U_FETCH_6: IC35.5(1C1)
U_FETCH_7: IC35.11(2C1)
U_FETCH_8: IC36.5(1C1)
U_FETCH_9: IC36.11(2C1)
U_FETCH_10: IC37.5(1C1)
U_FETCH_11: IC37.11(2C1)
U_FETCH_12: IC38.5(1C1)
U_FETCH_13: IC38.11(2C1) R6.1 SW2.8
U_FLAGS_REG_WRT: IC126.1(G)
U_INT_ADDR_0: IC173.2(1A)
U_INT_ADDR_1: IC173.5(2A)
U_INT_ADDR_2: IC173.11(3A)
U_INT_ADDR_3: IC173.14(4A)
U_INT_ADDR_4: IC169.2(1A)
U_INT_ADDR_5: IC169.5(2A)
U_INT_ADDR_6: IC169.11(3A)
U_INT_ADDR_7: IC169.14(4A)
U_INT_ADDR_8: IC171.2(1A)
U_INT_ADDR_9: IC171.5(2A)
U_INT_ADDR_10: IC171.11(3A)
U_INT_ADDR_11: IC171.14(4A)
U_INT_ADDR_12: IC172.2(1A)
U_INT_ADDR_13: IC172.5(2A)
U_OF: IC59.13(4B) IC126.9(4Q)
U_REQ_ADDR_0: IC41.3(1C3) IC173.4(1Y)
U_REQ_ADDR_1: IC41.13(2C3) IC173.7(2Y)
U_REQ_ADDR_2: IC40.3(1C3) IC173.9(3Y)
U_REQ_ADDR_3: IC40.13(2C3) IC173.12(4Y)
U_REQ_ADDR_4: IC34.3(1C3) IC169.4(1Y)
U_REQ_ADDR_5: IC34.13(2C3) IC169.7(2Y)
U_REQ_ADDR_6: IC35.3(1C3) IC169.9(3Y)
U_REQ_ADDR_7: IC35.13(2C3) IC169.12(4Y)
U_REQ_ADDR_8: IC36.3(1C3) IC171.4(1Y)
U_REQ_ADDR_9: IC36.13(2C3) IC171.7(2Y)
U_REQ_ADDR_10: IC37.3(1C3) IC171.9(3Y)
U_REQ_ADDR_11: IC37.13(2C3) IC171.12(4Y)
U_REQ_ADDR_12: IC38.3(1C3) IC172.4(1Y)
U_REQ_ADDR_13: IC38.13(2C3) IC172.7(2Y)
U_SF: IC59.10(3B) IC126.6(3Q)
U_ZF: IC59.3(1B) IC126.2(1Q) IC127.2(A:I1)
U_ZF_IN_SRC: IC121.1(!A!/B)
VCC: IC44.1(A:CLR) IC49.2(1A) IC56.5(1C1) IC163.2(A:D) IC163.4(A:PRE) IC164.2(A:D) IC164.4(A:PRE) IC168.2(A:D) IC168.4(A:PRE) IC174.2(A:D) IC174.4(A:PRE) IC187.2(A:D) IC187.4(A:PRE) IC188.2(A:D) IC188.4(A:PRE) IC221.2(A:D) IC221.4(A:PRE) IC222.6(G1) R1.2 R2.2 R3.2 R9.2 SW1.9 SW1.10 SW1.11 SW1.12 SW1.13 SW1.14 SW1.15 SW1.16 SW2.9 SW2.10 SW2.11 SW2.12 SW2.13 SW2.14 SW2.15 SW2.16
WR: IC69.7(B:Y2) R10.7
XBUS0: IC2.9(B:Y1) IC8.9(B:Y1) IC9.18(A:Y1) IC25.9(B:Y1) IC27.9(B:Y1) IC102.9(B:Y1) IC103.18(Y1) IC104.18(Y1) IC105.9(B:Y1) IC107.9(B:Y1) IC109.9(B:Y1) IC111.9(B:Y1) IC113.9(B:Y1) IC115.9(B:Y1) IC145.9(B:Y1) IC156.9(B:Y1) IC160.9(B:Y1) IC181.18(A:Y1) IC186.9(B:Y1) IC195.9(B:Y1) IC244.9(B:Y1) R8.9
XBUS1: IC2.7(B:Y2) IC8.7(B:Y2) IC9.16(A:Y2) IC25.7(B:Y2) IC27.7(B:Y2) IC102.7(B:Y2) IC104.17(Y2) IC105.7(B:Y2) IC107.7(B:Y2) IC109.7(B:Y2) IC111.7(B:Y2) IC113.7(B:Y2) IC115.7(B:Y2) IC145.7(B:Y2) IC156.7(B:Y2) IC160.7(B:Y2) IC181.16(A:Y2) IC186.7(B:Y2) IC195.7(B:Y2) IC244.7(B:Y2) R8.10
XBUS2: IC2.5(B:Y3) IC8.5(B:Y3) IC9.14(A:Y3) IC25.5(B:Y3) IC27.5(B:Y3) IC102.5(B:Y3) IC105.5(B:Y3) IC107.5(B:Y3) IC109.5(B:Y3) IC111.5(B:Y3) IC113.5(B:Y3) IC115.5(B:Y3) IC145.5(B:Y3) IC156.5(B:Y3) IC160.5(B:Y3) IC181.14(A:Y3) IC186.5(B:Y3) IC195.5(B:Y3) IC244.5(B:Y3) R8.11
XBUS3: IC2.3(B:Y4) IC8.3(B:Y4) IC9.12(A:Y4) IC25.3(B:Y4) IC27.3(B:Y4) IC102.3(B:Y4) IC105.3(B:Y4) IC107.3(B:Y4) IC109.3(B:Y4) IC111.3(B:Y4) IC113.3(B:Y4) IC115.3(B:Y4) IC145.3(B:Y4) IC156.3(B:Y4) IC160.3(B:Y4) IC181.12(A:Y4) IC186.3(B:Y4) IC195.3(B:Y4) IC244.3(B:Y4) R8.12
XBUS4: IC3.9(B:Y1) IC9.9(B:Y1) IC24.9(B:Y1) IC26.9(B:Y1) IC103.14(Y5) IC106.9(B:Y1) IC108.9(B:Y1) IC110.9(B:Y1) IC112.9(B:Y1) IC114.9(B:Y1) IC116.9(B:Y1) IC117.9(B:Y1) IC129.9(B:Y1) IC146.9(B:Y1) IC159.9(B:Y1) IC161.9(B:Y1) IC176.18(A:Y1) IC196.9(B:Y1) IC215.9(B:Y1) IC247.9(B:Y1) R8.13
XBUS5: IC3.7(B:Y2) IC9.7(B:Y2) IC24.7(B:Y2) IC26.7(B:Y2) IC106.7(B:Y2) IC108.7(B:Y2) IC110.7(B:Y2) IC112.7(B:Y2) IC114.7(B:Y2) IC116.7(B:Y2) IC117.7(B:Y2) IC129.7(B:Y2) IC146.7(B:Y2) IC159.7(B:Y2) IC161.7(B:Y2) IC176.16(A:Y2) IC196.7(B:Y2) IC215.7(B:Y2) IC247.7(B:Y2) R8.14
XBUS6: IC3.5(B:Y3) IC9.5(B:Y3) IC24.5(B:Y3) IC26.5(B:Y3) IC106.5(B:Y3) IC108.5(B:Y3) IC110.5(B:Y3) IC112.5(B:Y3) IC114.5(B:Y3) IC116.5(B:Y3) IC117.5(B:Y3) IC129.5(B:Y3) IC146.5(B:Y3) IC159.5(B:Y3) IC161.5(B:Y3) IC176.14(A:Y3) IC196.5(B:Y3) IC215.5(B:Y3) IC247.5(B:Y3) R8.15
XBUS7: IC3.3(B:Y4) IC9.3(B:Y4) IC24.3(B:Y4) IC26.3(B:Y4) IC80.4(B:I0) IC103.11(Y8) IC104.11(Y8) IC106.3(B:Y4) IC108.3(B:Y4) IC110.3(B:Y4) IC112.3(B:Y4) IC114.3(B:Y4) IC116.3(B:Y4) IC117.3(B:Y4) IC129.3(B:Y4) IC130.5(B:I1) IC146.3(B:Y4) IC159.3(B:Y4) IC161.3(B:Y4) IC176.12(A:Y4) IC196.3(B:Y4) IC215.3(B:Y4) IC247.3(B:Y4) R8.16
XBUS8: IC154.9(B:Y1)
XBUS9: IC154.7(B:Y2)
XBUS10: IC154.5(B:Y3)
XBUS11: IC154.3(B:Y4)
XBUS12: IC155.9(B:Y1)
XBUS13: IC155.7(B:Y2)
XBUS14: IC155.5(B:Y3)
XBUS15: IC155.3(B:Y4)
XBUS16: IC89.18(A:Y1) IC91.18(A:Y1)
XBUS17: IC89.16(A:Y2) IC91.16(A:Y2)
XBUS18: IC89.14(A:Y3) IC91.14(A:Y3)
XBUS19: IC89.12(A:Y4) IC91.12(A:Y4)
XBUS20: IC90.18(A:Y1) IC92.18(A:Y1)
XBUS21: IC90.16(A:Y2) IC92.16(A:Y2)
XBUS22: IC90.14(A:Y3) IC92.14(A:Y3)
XBUS23: IC90.12(A:Y4) IC92.12(A:Y4)
XBUS32: IC122.18(A:Y1)
XBUS33: IC122.16(A:Y2)
XBUS34: IC122.14(A:Y3)
XBUS35: IC122.12(A:Y4)
XBUS36: IC122.9(B:Y1)
XBUS37: IC122.7(B:Y2)
XBUS38: IC122.5(B:Y3)
XBUS39: IC122.3(B:Y4)
XBUS40: IC124.9(B:Y1)
XBUS41: IC124.7(B:Y2)
XBUS42: IC124.5(B:Y3)
XBUS43: IC124.3(B:Y4)
XBUS44: IC125.9(B:Y1)
XBUS45: IC125.7(B:Y2)
XBUS46: IC125.5(B:Y3)
XBUS47: IC125.3(B:Y4)
XBUS48: IC217.18(A:Y1)
XBUS49: IC217.16(A:Y2)
XBUS50: IC217.14(A:Y3)
XBUS51: IC217.12(A:Y4)
XBUS52: IC217.9(B:Y1)
XBUS53: IC217.7(B:Y2)
XBUS54: IC217.5(B:Y3)
XBUS55: IC217.3(B:Y4)
YBUS0: IC19.18(A:Y1) IC182.18(A:Y1)
YBUS1: IC19.16(A:Y2) IC182.16(A:Y2)
YBUS2: IC19.14(A:Y3) IC182.14(A:Y3)
YBUS3: IC19.12(A:Y4) IC182.12(A:Y4)
YBUS4: IC19.9(B:Y1) IC183.18(A:Y1)
YBUS5: IC19.7(B:Y2) IC183.16(A:Y2)
YBUS6: IC19.5(B:Y3) IC183.14(A:Y3)
YBUS7: IC19.3(B:Y4) IC130.4(B:I0) IC183.12(A:Y4)
YBUS16: IC211.18(A:Y1) IC213.18(A:Y1)
YBUS17: IC211.16(A:Y2) IC213.16(A:Y2)
YBUS18: IC211.14(A:Y3) IC213.14(A:Y3)
YBUS19: IC211.12(A:Y4) IC213.12(A:Y4)
YBUS20: IC212.18(A:Y1) IC214.18(A:Y1)
YBUS21: IC212.16(A:Y2) IC214.16(A:Y2)
YBUS22: IC212.14(A:Y3) IC214.14(A:Y3)
YBUS23: IC212.12(A:Y4) IC214.12(A:Y4)
YBUS40: IC229.18(A:Y1) IC231.18(A:Y1)
YBUS41: IC229.16(A:Y2) IC231.16(A:Y2)
YBUS42: IC229.14(A:Y3) IC231.14(A:Y3)
YBUS43: IC229.12(A:Y4) IC231.12(A:Y4)
YBUS44: IC230.18(A:Y1) IC232.18(A:Y1)
YBUS45: IC230.16(A:Y2) IC232.16(A:Y2)
YBUS46: IC230.14(A:Y3) IC232.14(A:Y3)
YBUS47: IC230.12(A:Y4) IC232.12(A:Y4)
YBUS48: IC235.18(A:Y1) IC237.18(A:Y1)
YBUS49: IC235.16(A:Y2) IC237.16(A:Y2)
YBUS50: IC235.14(A:Y3) IC237.14(A:Y3)
YBUS51: IC235.12(A:Y4) IC237.12(A:Y4)
YBUS52: IC236.18(A:Y1) IC238.18(A:Y1)
YBUS53: IC236.16(A:Y2) IC238.16(A:Y2)
YBUS54: IC236.14(A:Y3) IC238.14(A:Y3)
YBUS55: IC236.12(A:Y4) IC238.12(A:Y4)
ZBUFF0_16: IC86.3(1D) IC88.3(1D)
ZBUFF0_17: IC86.4(2D) IC88.4(2D)
ZBUFF0_18: IC86.7(3D) IC88.7(3D)
ZBUFF0_19: IC86.8(4D) IC88.8(4D)
ZBUFF0_20: IC86.13(5D) IC88.13(5D)
ZBUFF0_21: IC88.14(6D)
ZBUFF0_22: IC86.14(6D) IC86.17(7D) IC88.17(7D)
ZBUFF0_23: IC86.18(8D) IC88.18(8D)
ZBUFF0_24: IC16.3(1D) IC17.3(1D)
ZBUFF0_25: IC16.4(2D) IC17.4(2D)
ZBUFF0_26: IC16.7(3D) IC17.7(3D)
ZBUFF0_27: IC16.8(4D) IC17.8(4D)
ZBUFF0_28: IC16.13(5D) IC17.13(5D)
ZBUFF0_29: IC16.14(6D) IC17.14(6D)
ZBUFF0_30: IC16.17(7D) IC17.17(7D)
ZBUFF0_31: IC16.18(8D) IC17.18(8D)
ZBUFF0_56: IC233.3(1D) IC234.3(1D)
ZBUFF0_57: IC233.4(2D) IC234.4(2D)
ZBUFF0_58: IC233.7(3D) IC234.7(3D)
ZBUFF0_59: IC233.8(4D) IC234.8(4D)
ZBUFF0_60: IC233.13(5D) IC234.13(5D)
ZBUFF0_61: IC233.14(6D) IC234.14(6D)
ZBUFF0_62: IC233.17(7D) IC234.17(7D)
ZBUFF0_63: IC233.18(8D) IC234.18(8D)
ZBUFF0_64: IC239.3(1D) IC240.3(1D)
ZBUFF0_65: IC239.4(2D) IC240.4(2D)
ZBUFF0_66: IC239.7(3D) IC240.7(3D)
ZBUFF0_67: IC239.8(4D) IC240.8(4D)
ZBUFF0_68: IC239.13(5D) IC240.13(5D)
ZBUFF0_69: IC239.14(6D) IC240.14(6D)
ZBUFF0_70: IC239.17(7D) IC240.17(7D)
ZBUFF0_71: IC239.18(8D) IC240.18(8D)
ZBUFF1_0: IC4.3(1D) IC5.3(1D) IC98.3(1D) IC99.3(1D)
ZBUFF1_1: IC4.4(2D) IC5.4(2D) IC98.4(2D) IC99.4(2D)
ZBUFF1_2: IC4.7(3D) IC5.7(3D) IC98.7(3D) IC99.7(3D)
ZBUFF1_3: IC4.8(4D) IC5.8(4D) IC98.8(4D) IC99.8(4D)
ZBUFF1_4: IC4.13(5D) IC5.13(5D) IC98.13(5D) IC99.13(5D)
ZBUFF1_5: IC4.14(6D) IC5.14(6D) IC98.14(6D) IC99.14(6D)
ZBUFF1_6: IC4.17(7D) IC5.17(7D) IC98.17(7D) IC99.17(7D)
ZBUFF1_7: IC4.18(8D) IC5.18(8D) IC98.18(8D) IC99.18(8D)
ZBUFF2_0: IC1.3(1D) IC23.14(4A) IC100.3(1D) IC101.3(1D)
ZBUFF2_1: IC1.4(2D) IC23.11(3A) IC100.4(2D) IC101.4(2D)
ZBUFF2_2: IC1.7(3D) IC23.5(2A) IC100.7(3D) IC101.7(3D)
ZBUFF2_3: IC1.8(4D) IC23.2(1A) IC100.8(4D) IC101.8(4D)
ZBUFF2_4: IC1.13(5D) IC22.14(4A) IC100.13(5D) IC101.13(5D)
ZBUFF2_5: IC1.14(6D) IC22.11(3A) IC100.14(6D) IC101.14(6D)
ZBUFF2_6: IC1.17(7D) IC22.5(2A) IC100.17(7D) IC101.17(7D)
ZBUFF2_7: IC22.2(1A) IC100.18(8D) IC101.18(8D)
ZBUFF2_16: IC123.3(1D)
ZBUFF2_17: IC123.4(2D)
ZBUFF2_18: IC123.7(3D)
ZBUFF2_19: IC123.8(4D)
ZBUFF2_20: IC123.13(5D)
ZBUFF2_21: IC123.14(6D)
ZBUFF2_22: IC123.17(7D)
ZBUFF2_23: IC153.3(1D)
ZBUFF2_24: IC153.4(2D)
ZBUFF2_25: IC153.7(3D)
ZBUFF2_26: IC153.8(4D)
ZBUFF2_27: IC153.13(5D)
ZBUFF2_28: IC153.14(6D)
ZBUFF2_29: IC153.17(7D)
ZBUFF2_30: IC153.18(8D)
ZBUFF2_31: IC185.3(1D)
ZBUFF2_32: IC185.4(2D)
ZBUFF2_33: IC185.7(3D)
ZBUFF2_34: IC185.8(4D)
ZBUFF2_35: IC185.13(5D)
ZBUFF2_36: IC185.14(6D)
ZBUFF2_37: IC185.17(7D)
ZBUFF2_38: IC185.18(8D)
ZBUS0: IC6.3(1D) IC7.3(1D) IC47.3(1B) IC48.3(1D) IC96.2(1A) IC97.2(1A) IC144.14(D1) IC175.4(B:I0) IC184.3(1D) IC189.3(1D) IC197.1(A:I0) IC216.3(1D) IC245.18(A:Y1) IC248.14(D1)
ZBUS1: IC14.10(F1) IC47.6(2B) IC96.5(2A) IC97.5(2A) IC144.13(D2) IC175.5(B:I1) IC184.4(2D) IC197.2(A:I1) IC216.4(2D) IC245.4(A:A2) IC245.16(A:Y2) IC248.13(D2)
ZBUS2: IC14.11(F2) IC47.10(3B) IC96.11(3A) IC97.11(3A) IC144.12(D3) IC177.5(B:I1) IC184.7(3D) IC197.3(A:I2) IC216.7(3D) IC245.6(A:A3) IC245.14(A:Y3) IC248.12(D3)
ZBUS3: IC14.13(F3) IC47.13(4B) IC96.14(4A) IC97.14(4A) IC144.11(D4) IC184.8(4D) IC192.5(B:I1) IC197.12(A:I3) IC216.8(4D) IC245.8(A:A4) IC245.12(A:Y4) IC248.11(D4)
ZBUS4: IC15.13(F3) IC94.2(1A) IC95.2(1A) IC128.14(D1) IC184.13(5D) IC193.5(B:I1) IC197.13(A:I4) IC210.3(1B) IC216.13(5D) IC246.8(A:A4) IC246.18(A:Y1) IC249.14(D1)
ZBUS5: IC15.11(F2) IC94.5(2A) IC95.5(2A) IC128.13(D2) IC184.14(6D) IC194.5(B:I1) IC199.2(A:I1) IC216.14(6D) IC246.6(A:A3) IC246.16(A:Y2) IC249.13(D2)
ZBUS6: IC15.10(F1) IC94.11(3A) IC95.11(3A) IC128.12(D3) IC184.17(7D) IC199.3(A:I2) IC200.5(B:I1) IC216.17(7D) IC246.4(A:A2) IC246.14(A:Y3) IC249.12(D3)
ZBUS7: IC6.18(8D) IC7.18(8D) IC15.9(F0) IC47.11(3A) IC48.18(8D) IC80.5(B:I1) IC94.14(4A) IC95.14(4A) IC128.11(D4) IC184.18(8D) IC189.18(8D) IC199.12(A:I3) IC209.5(B:I1) IC216.18(8D) IC246.2(A:A1) IC246.12(A:Y4) IC249.11(D4)
ZF: IC46.2(1Q) IC59.2(1A) IC120.2(A:I1) IC195.11(B:A1)
ZF_FROM_ALU: IC119.2(1A) IC120.1(A:I0) IC121.2(1A) IC127.1(A:I0) IC199.5(A:O)
ZF_IN_SRC: IC119.1(!A!/B)
~RST: IC44.4(A:PRE) IC54.4(B:O) IC162.1(CLR) IC208.1(A:I0) IC218.1(A:I0) IC219.1(A:I0) IC220.2(A:I1) IC223.2(A:I1) IC224.2(A:I1) IC225.2(A:I1)